# Altium project IT_Asset_Tracking_Rack_Controller-H743.PrjPcb (part 1 of 3)
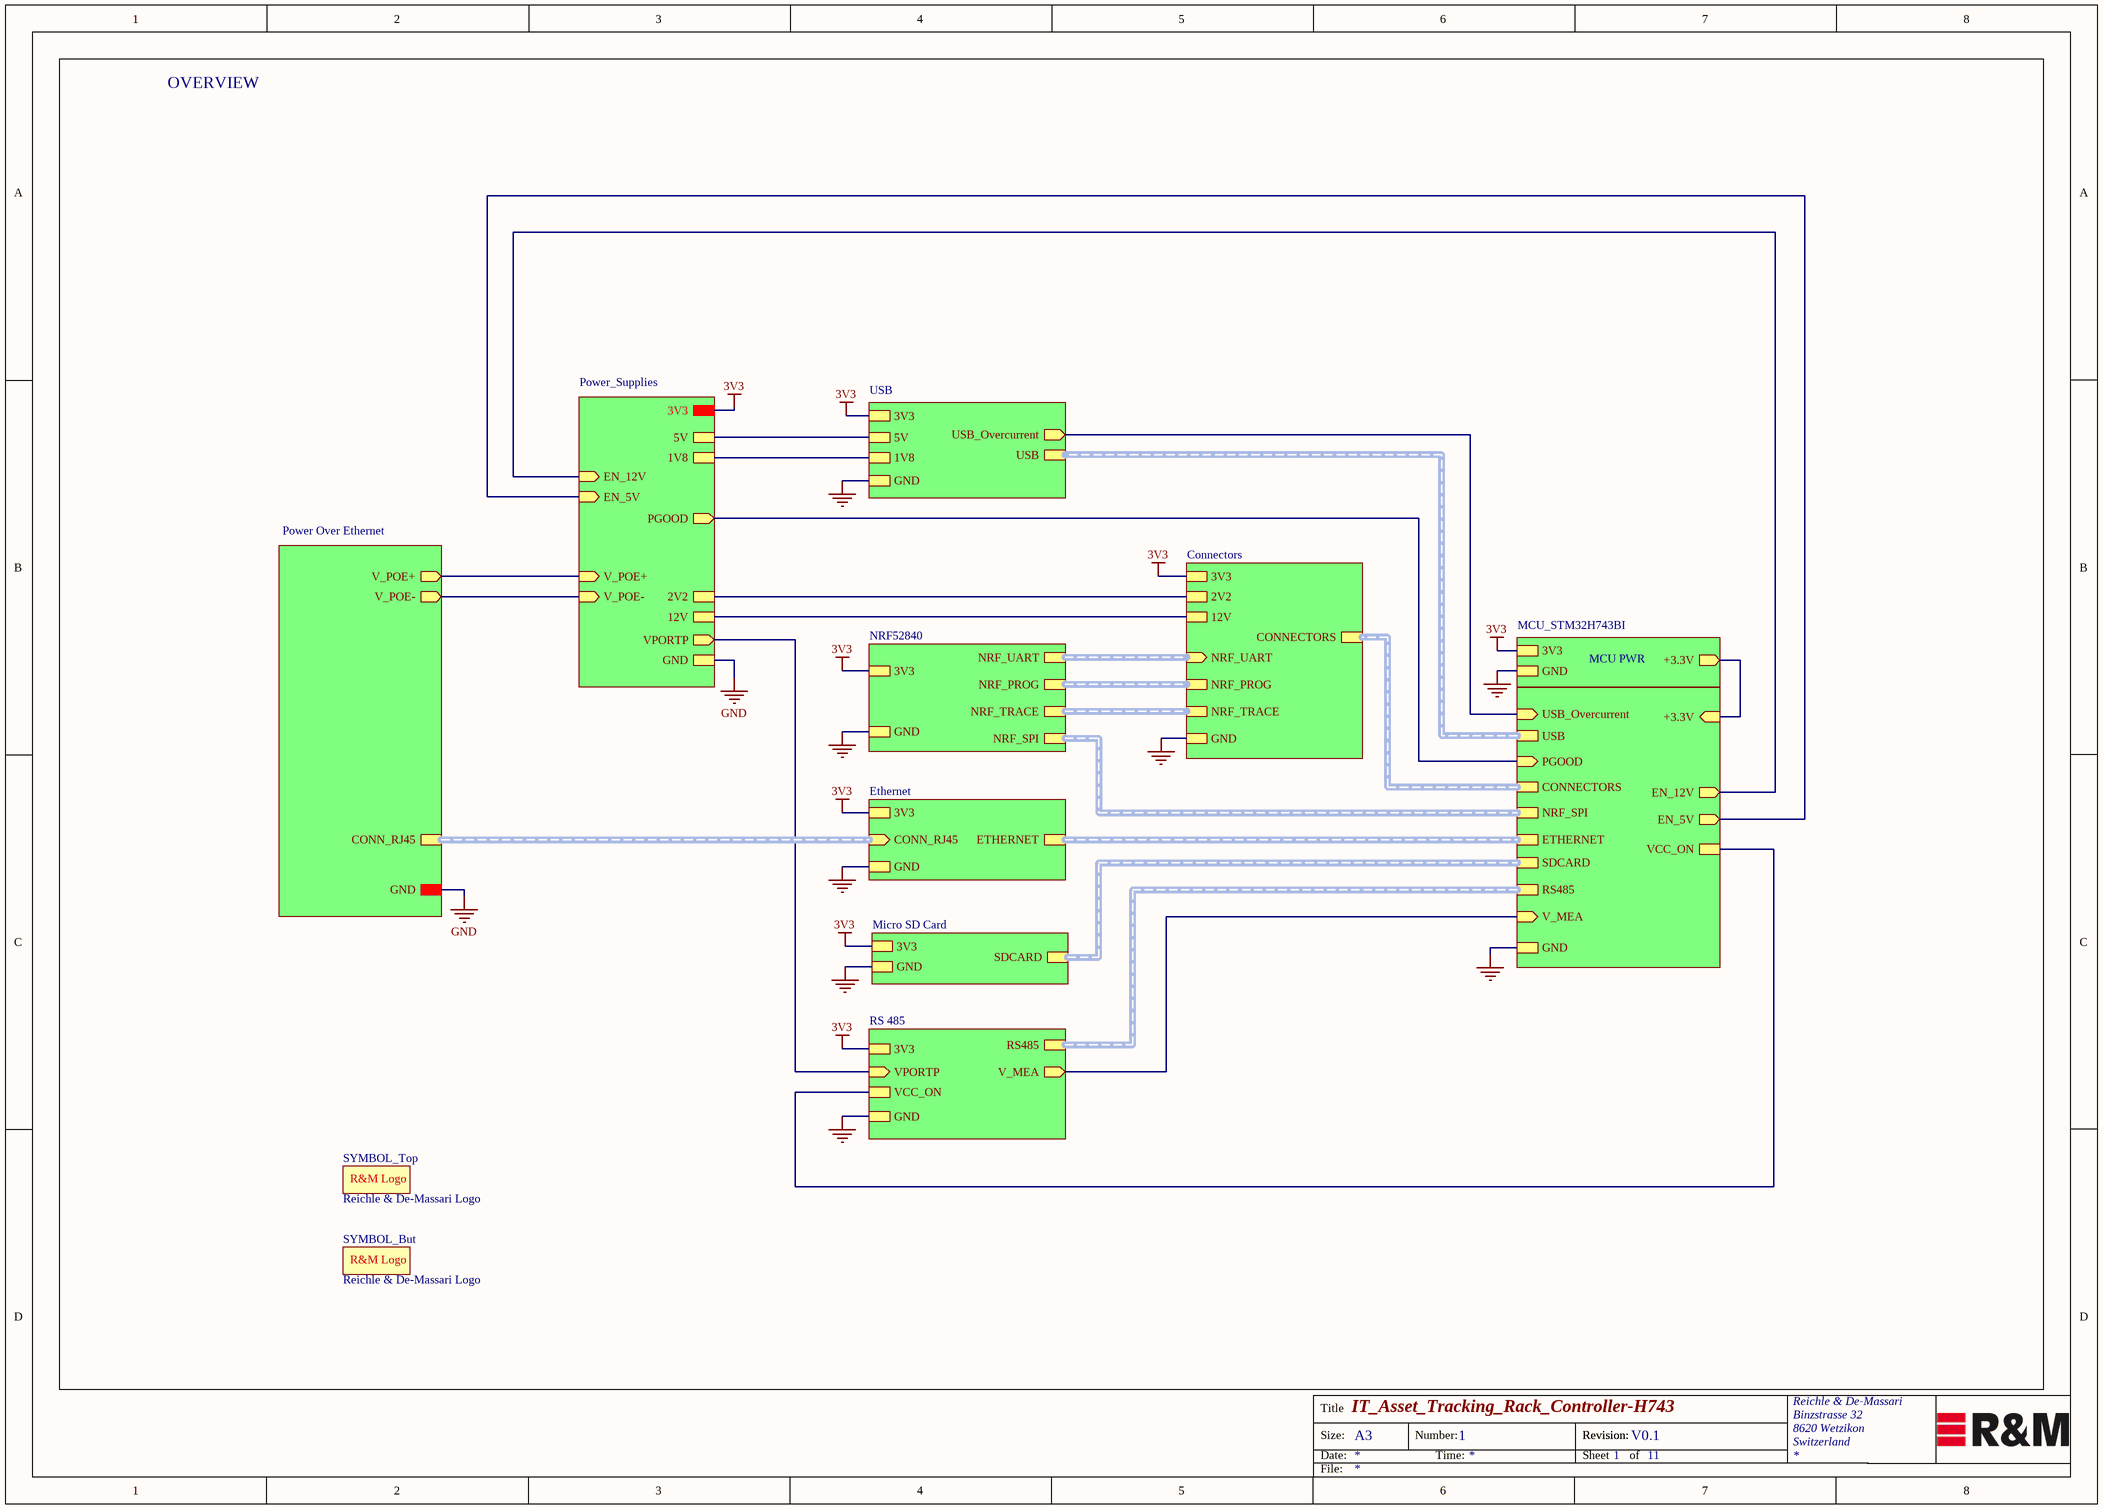
[diagram p0: IT_Asset_Tracking_Rack_Controller-H743.SchDoc]
11 sheets, 255 parts. Net scope: hierarchical (ports join the sheet entries above them; power ports are global).
Board file: IT_Asset_Tracking_Rack_Controller-H743.PcbDoc
Sheets:
  IT_Asset_Tracking_Rack_Controller-H743.SchDoc
    Power Over Ethernet = Power_Over_Ethernet.SchDoc
    USB = USB.SchDoc
    Ethernet = Ethernet.SchDoc
    MCU_STM32H743BI = MCU_STM32H743BI.SchDoc
    MCU PWR = MCU_STM32H743BI_POWER.SchDoc
    Micro SD Card = Micro_SD_Card.SchDoc
    NRF52840 = NRF52840.SchDoc
    RS 485 = RS-485.SchDoc
    Connectors = Connectors.SchDoc
    Power_Supplies = Power_Supplies.SchDoc

## Sheet IT_Asset_Tracking_Rack_Controller-H743.SchDoc: IT_Asset_Tracking_Rack_Controller-H743
size A3; Engineer: Attila Horvath; Organization: Reichle & De-Massari; Address1: Binzstrasse 32; Address2: 8620 Wetzikon; Address3: Switzerland; DocumentNumber: 1; Revision: V0.1; SheetNumber: 1; SheetTotal: 11

### Parts
SYMBOL_But  Reichle & De-Massari Logo  [SYMBOL_R&M]  (net tie)
SYMBOL_Top  Reichle & De-Massari Logo  [SYMBOL_R&M]  (net tie)

### Sub-sheets
Connectors = Connectors.SchDoc: NRF_UART (in, harness NRF_UART), NRF_PROG (harness NRF_PROG), NRF_TRACE (harness NRF_TRACE), CONNECTORS (harness CONNECTORS), 3V3, 2V2, 12V, GND
Ethernet = Ethernet.SchDoc: 3V3, GND, CONN_RJ45 (in, harness CONN_RJ45), ETHERNET (harness ETHERNET)
MCU PWR = MCU_STM32H743BI_POWER.SchDoc: 3V3, GND, +3.3V (out)
MCU_STM32H743BI = MCU_STM32H743BI.SchDoc: USB (harness USB), ETHERNET (harness ETHERNET), SDCARD (harness SD_CARD), NRF_SPI (harness NRF_SPI), USB_Overcurrent (in), RS485 (harness MCU_RS485), EN_12V (out), EN_5V (out), V_MEA (in), GND, CONNECTORS (harness CONNECTORS), +3.3V (in), PGOOD (in), VCC_ON
Micro SD Card = Micro_SD_Card.SchDoc: 3V3, GND, SDCARD (harness SD_CARD)
NRF52840 = NRF52840.SchDoc: 3V3, GND, NRF_TRACE (harness NRF_TRACE), NRF_SPI (harness NRF_SPI), NRF_UART (harness NRF_UART), NRF_PROG (harness NRF_PROG)
Power Over Ethernet = Power_Over_Ethernet.SchDoc: V_POE+ (out), V_POE- (out), CONN_RJ45 (harness CONN_RJ45), GND
Power_Supplies = Power_Supplies.SchDoc: 3V3, 5V, 1V8, 2V2, 12V, V_POE- (in), V_POE+ (in), EN_5V (in), EN_12V (in), GND, PGOOD (out), VPORTP (out)
RS 485 = RS-485.SchDoc: 3V3, GND, RS485 (harness MCU_RS485), V_MEA (out), VCC_ON, VPORTP (in)
USB = USB.SchDoc: 1V8, 3V3, 5V, USB (harness USB), USB_Overcurrent (out), GND

### Nets
1V8: sheet USB/1V8, sheet Power_Supplies/1V8
2V2OUT: sheet Connectors/2V2, sheet Power_Supplies/2V2
3V3: sheet USB/3V3, sheet Ethernet/3V3, sheet MCU PWR/3V3, sheet Micro SD Card/3V3, sheet NRF52840/3V3, sheet RS 485/3V3, sheet Connectors/3V3, sheet Power_Supplies/3V3
5VOUT: sheet USB/5V, sheet Power_Supplies/5V
12VOUT: sheet Connectors/12V, sheet Power_Supplies/12V
+3.3V: sheet MCU_STM32H743BI/+3.3V, sheet MCU PWR/+3.3V
GND: sheet Power Over Ethernet/GND, sheet USB/GND, sheet Ethernet/GND, sheet MCU_STM32H743BI/GND, sheet MCU PWR/GND, sheet Micro SD Card/GND, sheet NRF52840/GND, sheet RS 485/GND, sheet Connectors/GND, sheet Power_Supplies/GND
VPORTP: sheet RS 485/VPORTP, sheet Power_Supplies/VPORTP
EN_5V: sheet MCU_STM32H743BI/EN_5V, sheet Power_Supplies/EN_5V
EN_12V: sheet MCU_STM32H743BI/EN_12V, sheet Power_Supplies/EN_12V
PGOOD: sheet MCU_STM32H743BI/PGOOD, sheet Power_Supplies/PGOOD
USB_OverCurrent: sheet USB/USB_Overcurrent, sheet MCU_STM32H743BI/USB_Overcurrent
V_MEA: sheet MCU_STM32H743BI/V_MEA, sheet RS 485/V_MEA
V_POE+: sheet Power Over Ethernet/V_POE+, sheet Power_Supplies/V_POE+
V_POE-: sheet Power Over Ethernet/V_POE-, sheet Power_Supplies/V_POE-
VCC_ON: sheet MCU_STM32H743BI/VCC_ON, sheet RS 485/VCC_ON

### Buses and harness runs
harness sheet Connectors/CONNECTORS = sheet MCU_STM32H743BI/CONNECTORS
harness sheet Connectors/NRF_PROG = sheet NRF52840/NRF_PROG
harness sheet Connectors/NRF_TRACE = sheet NRF52840/NRF_TRACE
harness sheet Connectors/NRF_UART = sheet NRF52840/NRF_UART
harness sheet Ethernet/CONN_RJ45 = sheet Power Over Ethernet/CONN_RJ45
harness sheet Ethernet/ETHERNET = sheet MCU_STM32H743BI/ETHERNET
harness sheet MCU_STM32H743BI/NRF_SPI = sheet NRF52840/NRF_SPI
harness sheet MCU_STM32H743BI/RS485 = sheet RS 485/RS485
harness sheet MCU_STM32H743BI/SDCARD = sheet Micro SD Card/SDCARD
harness sheet MCU_STM32H743BI/USB = sheet USB/USB

### Notes on the sheet
- OVERVIEW
- Title
- Size:
- Date:
- A3
- Number:
- Time:
- Revision:
- Sheet
- of
- File:
- (in symbol SYMBOL_R&M) R&M Logo

### Library data of the parts
SYMBOL_But SYMBOL_Top = SYMBOL_R&M: Replaceable: no; value: Overlay; Footprint/Package: 2.54mm

## Sheet Power_Over_Ethernet.SchDoc: Power over Ethernet
size A3; Organization: Reichle & De-Massari; Address1: Binzstrasse 32; Address2: 8620 Wetzikon; Address3: Switzerland; DocumentNumber: 4; Revision: V0.1; SheetNumber: 4; SheetTotal: 11
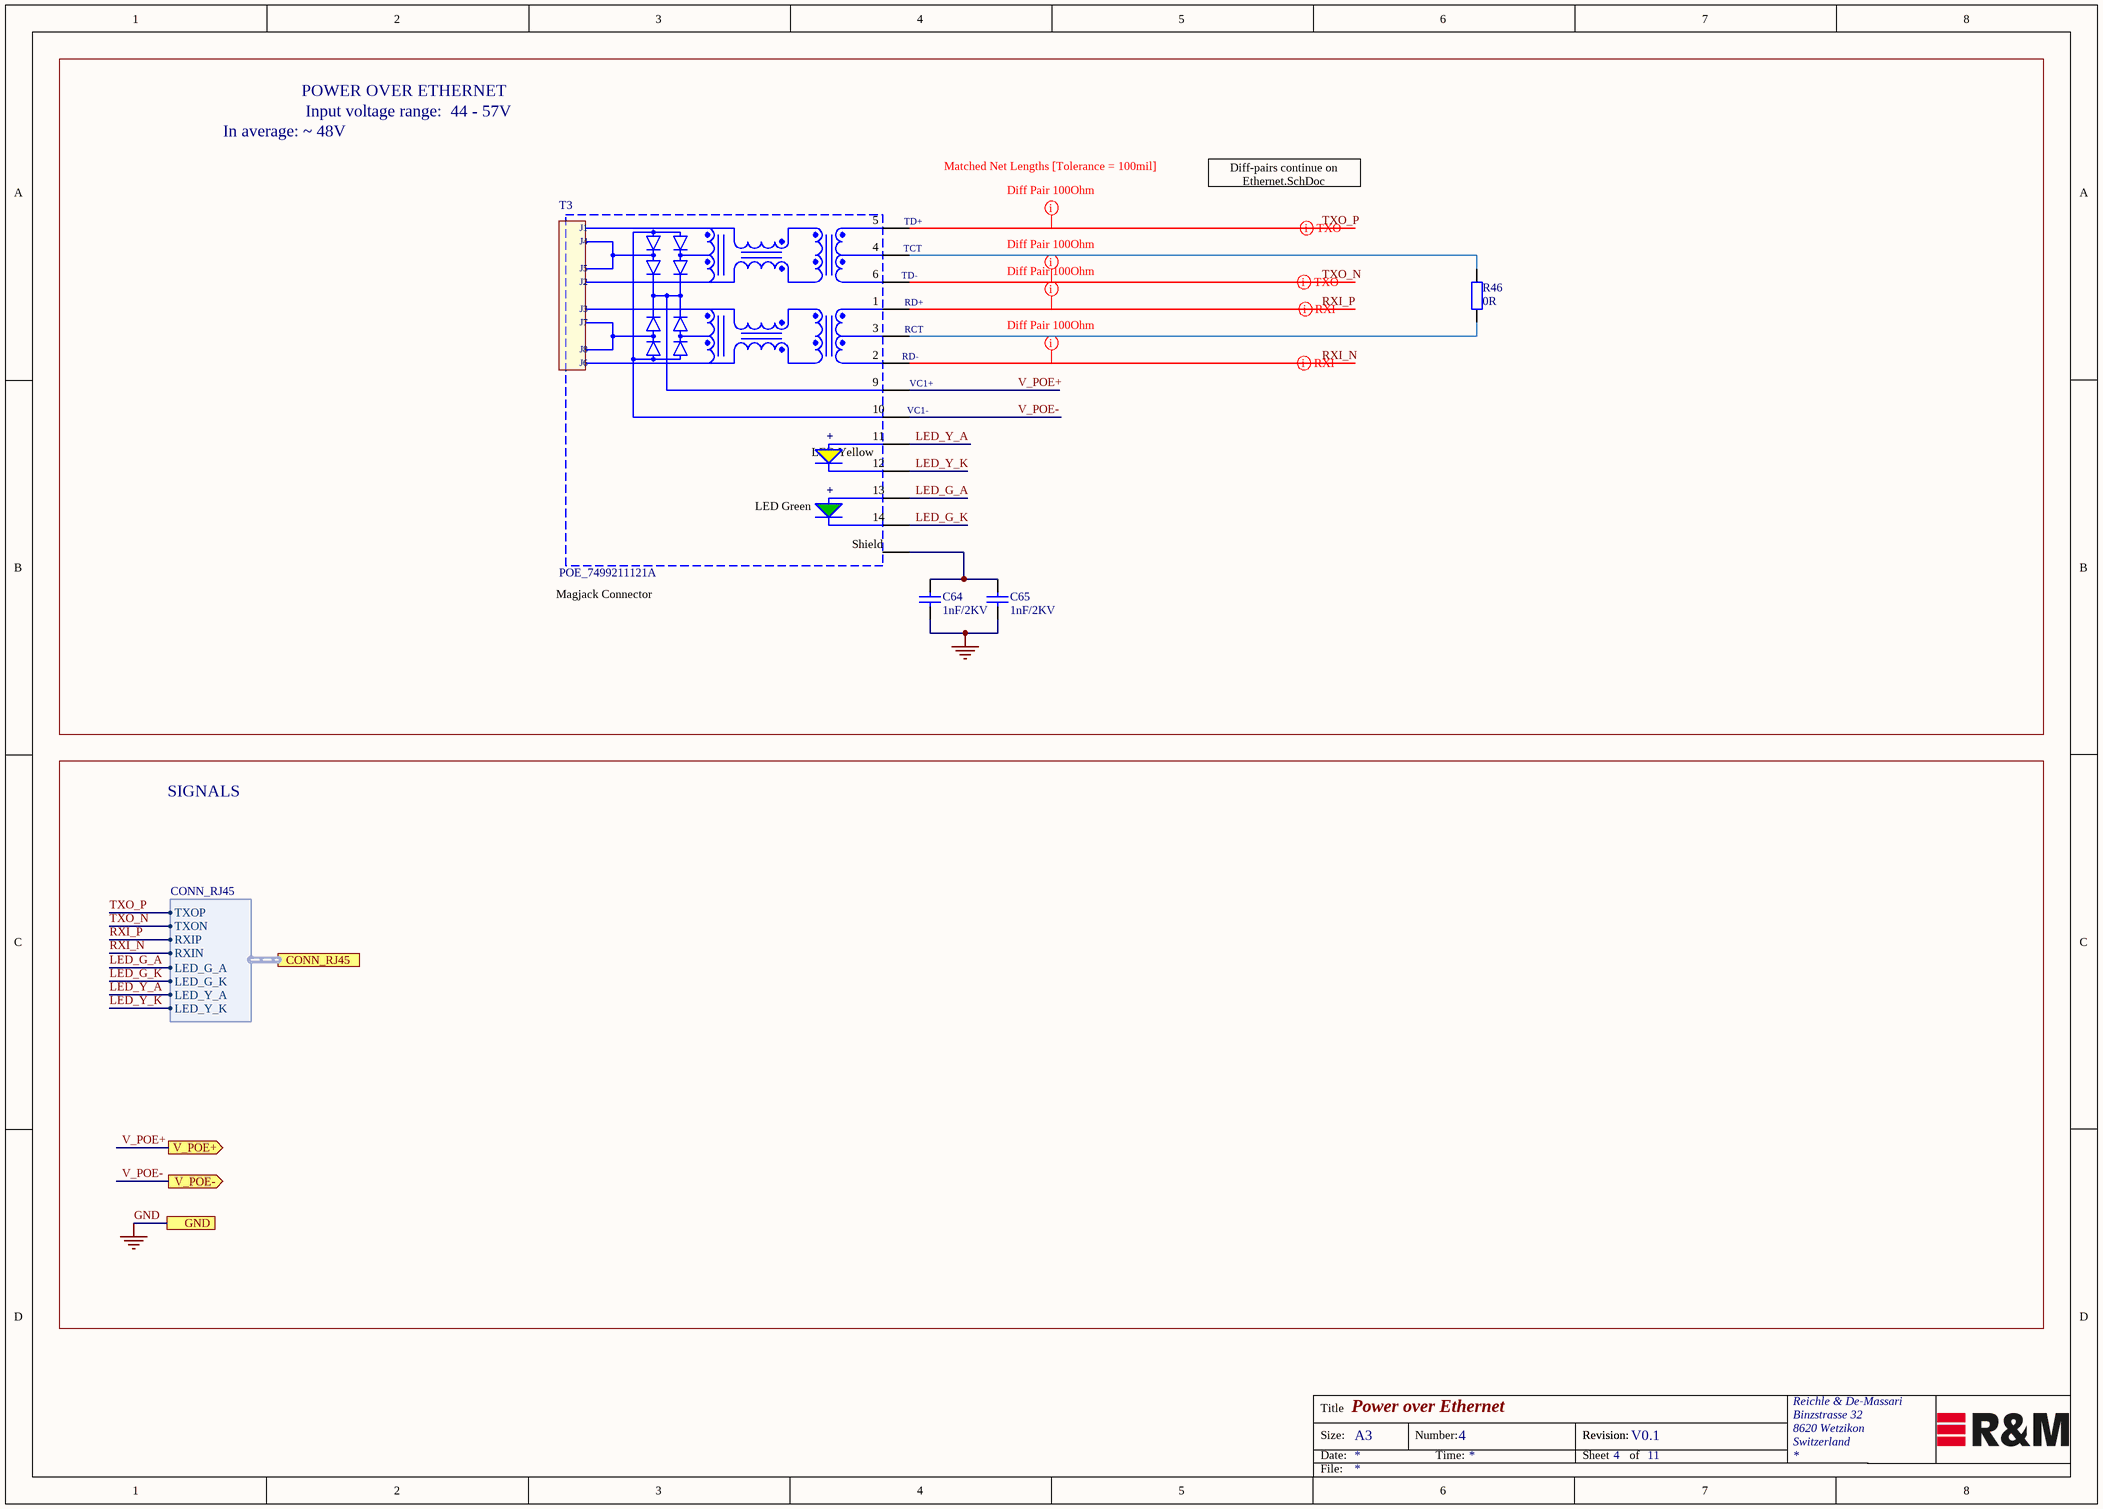
[diagram p1: Power_Over_Ethernet.SchDoc]

### Parts
C64  1nF/2KV  [Ceramic Capacitor 1206 EIA]
C65  1nF/2KV  [Ceramic Capacitor 1206 EIA]
R46  0R  [Resistor 0805 EIA]
T3  POE_7499211121A  [PoE_7499211121A]

### Ports
CONN_RJ45 (harness CONN_RJ45), GND, V_POE+ (out), V_POE- (out)

### Harnesses
CONN_RJ45: TXOP, TXON, RXIP, RXIN, LED_G_A, LED_G_K, LED_Y_A, LED_Y_K

### Nets
GND: C64.1 C65.1 ; port GND
LED_G_A: T3.13 ; port CONN_RJ45.LED_G_A
LED_G_K: T3.14 ; port CONN_RJ45.LED_G_K
LED_Y_A: T3.11 ; port CONN_RJ45.LED_Y_A
LED_Y_K: T3.12 ; port CONN_RJ45.LED_Y_K
RXI_N: T3.2(RD-) ; port CONN_RJ45.RXIN
RXI_P: T3.1(RD+) ; port CONN_RJ45.RXIP
TXO_N: T3.6(TD-) ; port CONN_RJ45.TXON
TXO_P: T3.5(TD+) ; port CONN_RJ45.TXOP
V_POE+: T3.9(VC1+) ; port V_POE+
V_POE-: T3.10(VC1-) ; port V_POE-
NetC64_2: C64.2 C65.2 T3.Shield
NetR46_1: R46.1 T3.4(TCT)
NetR46_2: R46.2 T3.3(RCT)

### Layout directives
mark named Diff Pair 100Ohm: RXI_N, RXI_P, TXO_N, TXO_P
differential pair: RXI_N, RXI_P, TXO_N, TXO_P

### Notes on the sheet
- POWER OVER ETHERNET
- In average: ~ 48V
- Input voltage range:  44 - 57V
- Matched Net Lengths [Tolerance = 100mil]
- Diff-pairs continue on Ethernet.SchDoc
- Magjack Connector
- SIGNALS
- Title
- Size:
- Date:
- A3
- Number:
- Time:
- Revision:
- Sheet
- of
- File:
- (in symbol CONN_RJ45_PoE) J1; J4; J5; J2; J3; J7; J8; J6; +; LED Yellow; LED Green

### Library data of the parts
C64 C65 = Cap_1nF_1206_2000V: 1000pF ±10% 2000V (2kV) Ceramic Capacitor X7R 1206 (3216 Metric); Manufacturer: AVX Corporation; Manufacturer PartNr: 1206GC102KAZ1A; Replaceable: yes; value: 1nF/2KV; tolerance: ±10%; voltage: 2kV; Dielectric Grade: X7R; Footprint/Package: 1206 (3216 Metric); Supplier 1: Digi-Key; Supplier Part Number 1: 478-4600-1-ND
R46 = Res_0R_0805: 0 Ohms Jumper 0.125W, 1/8W Chip Resistor 0805 (2012 Metric) Automotive AEC-Q200 Thick Film; Manufacturer: Panasonic Electronic Components; Manufacturer PartNr: ERJ-6GEY0R00V; Replaceable: yes; value: 0R; tolerance: -; power: 0.125W, 1/8W; Footprint/Package: 0805 (2012 metric); Supplier 1: Digi-Key; Supplier Part Number 1: P0.0ACT-ND
T3 = CONN_RJ45_PoE: Magjack Connector WE-RJ45 (PoE) with LAN Transformer, 10/100 Base-T1 Port RJ45, 10/100 Base-T, AutoMDIX, two LEDs; power: PoE (up to 350 mA); Replaceable: no; tolerance: NA; Manaufacturer: Wurth Elektronik; ComponentLink1Description: Manufacturer; ComponentLink1URL: http://www.we-online.de; ComponentLink2Description: Datasheet; ComponentLink2URL: http://katalog.we-online.de/pbs/datasheet/7499211121A.pdf; Manufacturer PartNr: 7499211121A; Supplier 1: Digi-Key; Supplier Part Number 1: 732-1654-ND; value: POE_7499211121A; DIelectric Grade: NA; voltage: NA

## Sheet USB.SchDoc: USB with connector
size A3; Organization: Reichle & De-Massari; Address1: Binzstrasse 32; Address2: 8620 Wetzikon; Address3: Switzerland; DocumentNumber: 6; Revision: V0.1; SheetNumber: 6; SheetTotal: 11
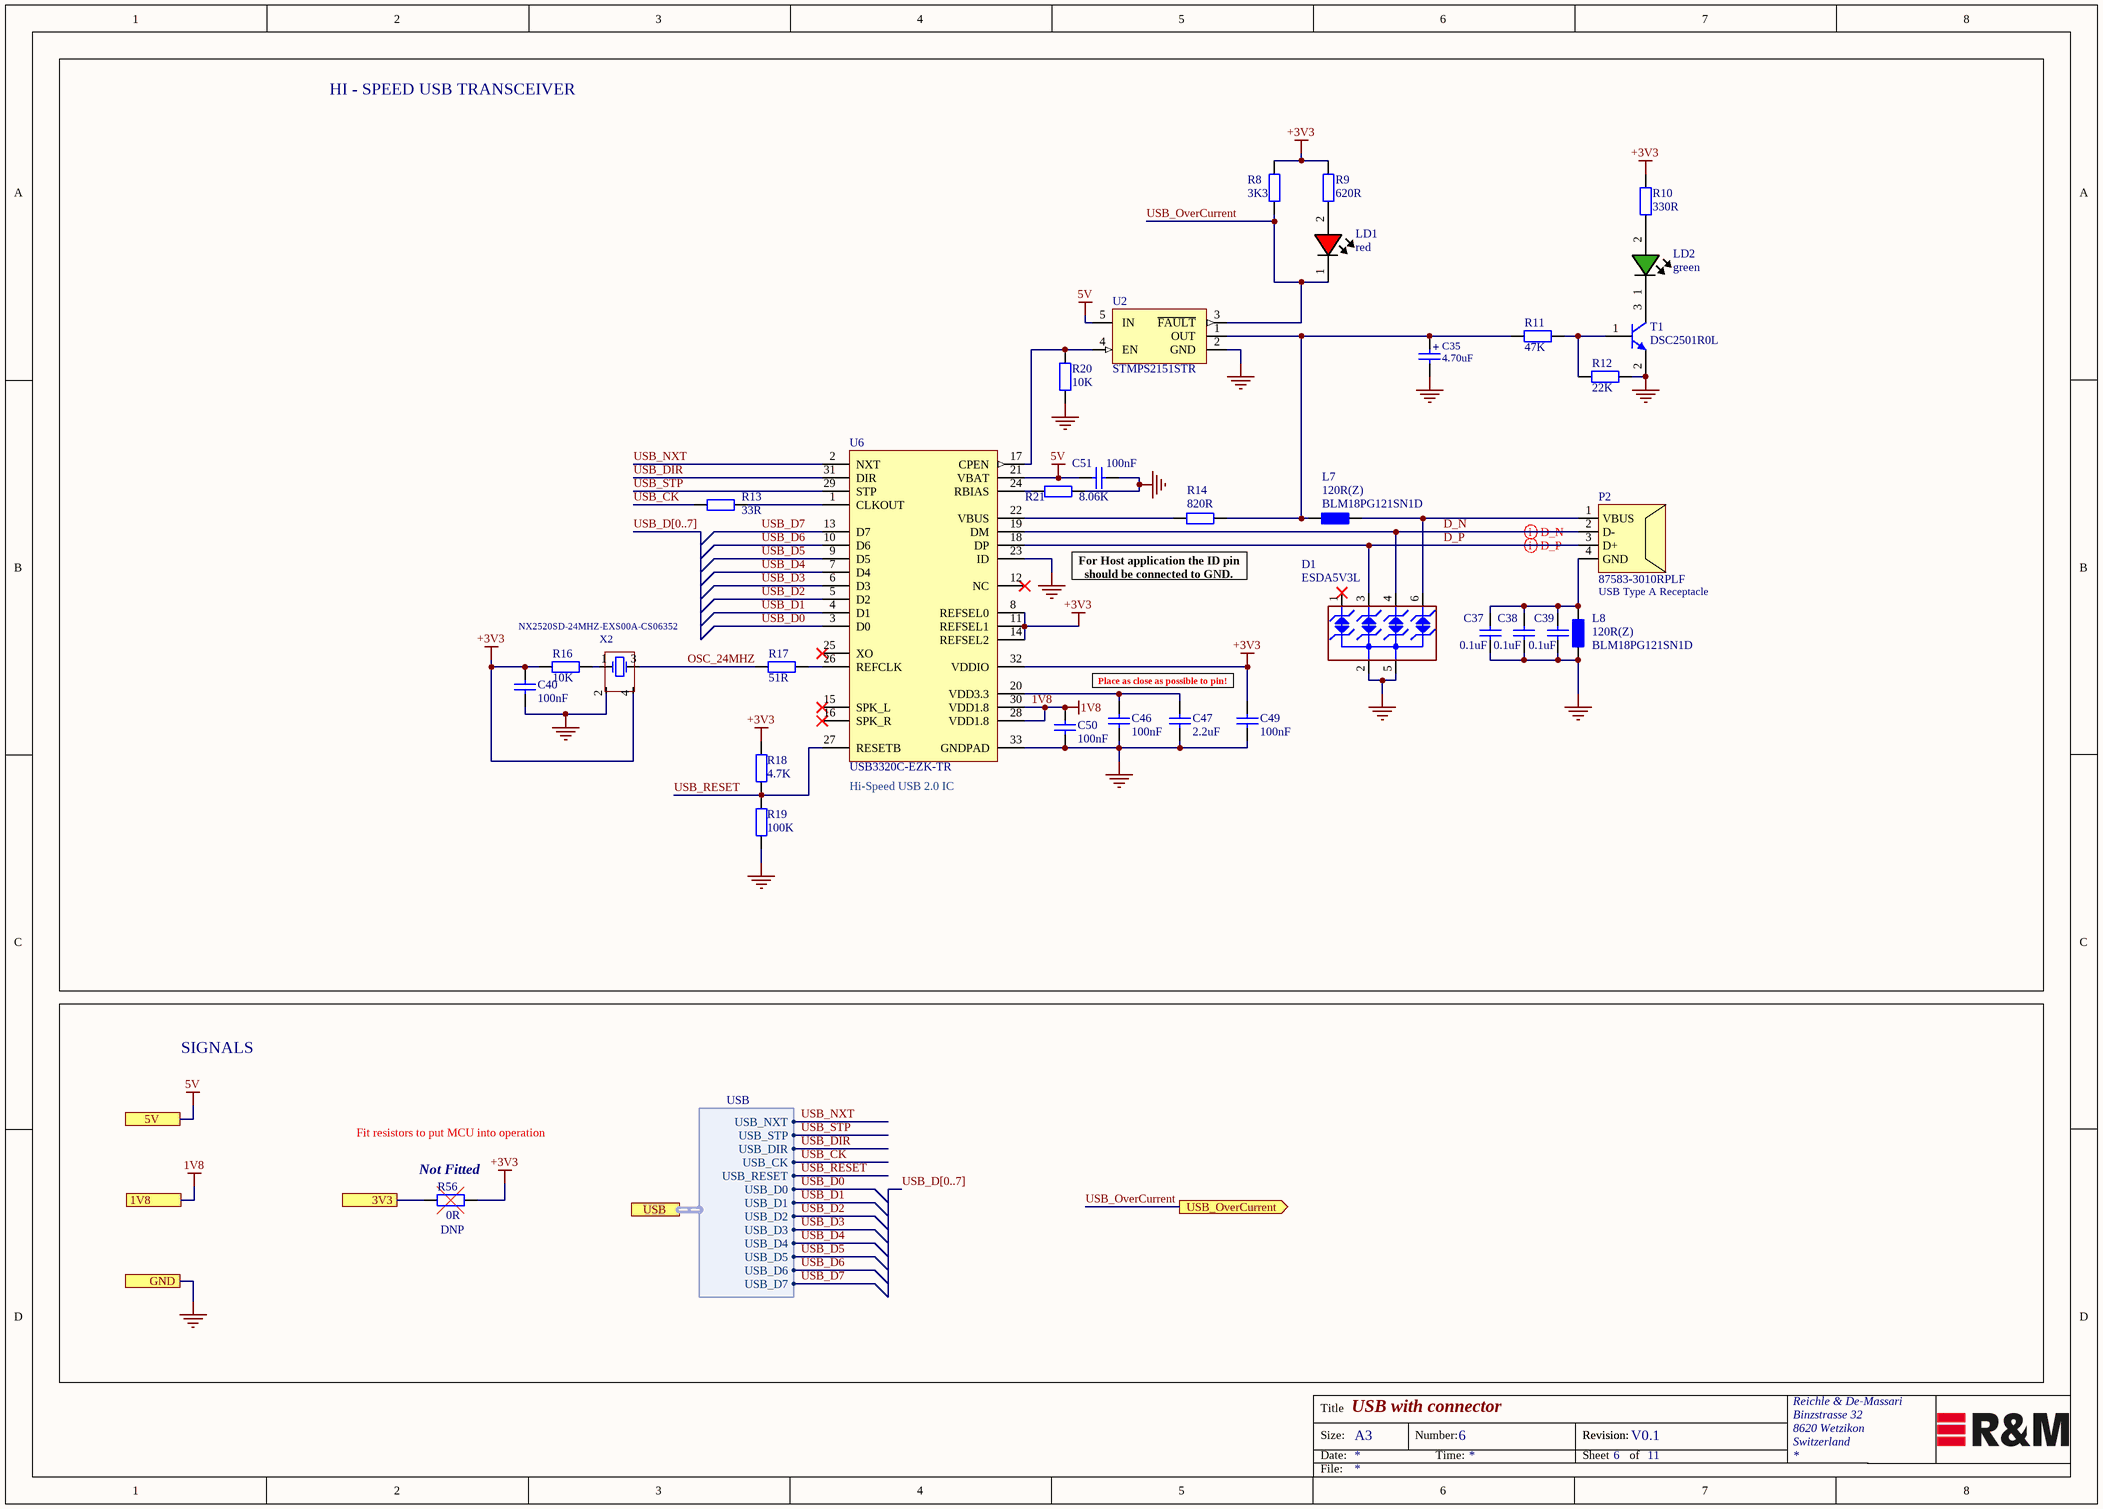
[diagram p2: USB.SchDoc]

### Parts
C35  4.70uF  [CAPC1608X90]
C37  0.1uF  [Ceramic Capacitor 0402 EIA]
C38  0.1uF  [Ceramic Capacitor 0402 EIA]
C39  0.1uF  [Ceramic Capacitor 0402 EIA]
C40  100nF  [Ceramic Capacitor 0402 EIA]
C46  100nF  [Ceramic Capacitor 0402 EIA]
C47  2.2uF  [Ceramic Capacitor 0402 EIA]
C49  100nF  [Ceramic Capacitor 0402 EIA]
C50  100nF  [Ceramic Capacitor 0402 EIA]
C51  100nF  [Ceramic Capacitor 0402 EIA]
D1  ESDA5V3L  [SOT23-6L]
L7  120R(Z)  Manufacturer PartNr: BLM18PG121SN1D  [Inductor 0603 EIA]
L8  120R(Z)  Manufacturer PartNr: BLM18PG121SN1D  [Inductor 0603 EIA]
LD1  red  [LED_APHHS1005CGCK]
LD2  green  [LED_APHHS1005CGCK]
P2  87583-3010RPLF  [CONN_RCPT_USB_TYPE_A]
R8  3K3  [Resistor 0402 EIA]
R9  620R  [Resistor 0402 EIA]
R10  330R  [Resistor 0402 EIA]
R11  47K  [Resistor 0402 EIA]
R12  22K  [Resistor 0402 EIA]
R13  33R  [Resistor 0402 EIA]
R14  820R  [Resistor 0402 EIA]
R16  10K  [Resistor 0402 EIA]
R17  51R  [Resistor 0402 EIA]
R18  4.7K  [Resistor 0402 EIA]
R19  100K  [Resistor 0402 EIA]
R20  10K  [Resistor 0402 EIA]
R21  8.06K  [Resistor 0402 EIA]
R56  DNP  [Resistor 0805 EIA]
T1  DSC2501R0L  [SOT-23/TO-236AA]
U2  STMPS2151STR  [SOT23-5L]
U6  USB3320C-EZK-TR  [QFN32_0R5_5X5]
X2  NX2520SD-24MHZ-EXS00A-CS06352  [NX2520SD-24MHZ-EX]

### Blocks framed on the sheet
HI - SPEED USB TRANSCEIVER: C35 C37-C40 C46 C47 C49-C51 D1 L7 L8 LD1 LD2 P2 R8-R14 R16-R21 T1 U2 U6 X2
SIGNALS: R56

### Ports
1V8, 3V3, 5V, GND, USB (harness USB), USB_OverCurrent (out)

### Harnesses
USB: USB_STP, USB_DIR, USB_CK, USB_NXT, USB_RESET, USB_D0, USB_D1, USB_D2, USB_D3, USB_D4, USB_D5, USB_D6, USB_D7

### Nets
1V8: C50.2 U6.28(VDD1.8) U6.30(VDD1.8) ; port 1V8
3V3: R56.1 ; port 3V3
5V: C51.2 U2.5(IN) U6.21(VBAT) ; port 5V  [project net 5VOUT]
+3V3: C40.2 C49.2 R8.2 R9.1 R10.1 R16.1 R18.1 R56.2 U6.8(REFSEL0) U6.11(REFSEL1) U6.14(REFSEL2) U6.32(VDDIO) X2.4(OSC3)
GND: C35.2(Neg) C37.1 C38.1 C39.1 C40.1 C46.1 C47.1 C49.1 C50.1 C51.1 D1.2(IO2) D1.5(IO4) L8.1 R12.2 R19.2 R20.2 R21.2 T1.2(E) U2.2(GND) U6.23(ID) U6.33(GNDPAD) X2.2(OSC2) ; port GND
D_N: D1.4(IO3) P2.2(D-) U6.19(DM)
D_P: D1.3(GND) P2.3(D+) U6.18(DP)
OSC_24MHZ: R17.1 X2.3(OSC2)
USB_CK: R13.1 ; port USB.USB_CK
USB_D0: U6.3(D0) ; port USB.USB_D0
USB_D1: U6.4(D1) ; port USB.USB_D1
USB_D2: U6.5(D2) ; port USB.USB_D2
USB_D3: U6.6(D3) ; port USB.USB_D3
USB_D4: U6.7(D4) ; port USB.USB_D4
USB_D5: U6.9(D5) ; port USB.USB_D5
USB_D6: U6.10(D6) ; port USB.USB_D6
USB_D7: U6.13(D7) ; port USB.USB_D7
USB_DIR: U6.31(DIR) ; port USB.USB_DIR
USB_NXT: U6.2(NXT) ; port USB.USB_NXT
USB_OverCurrent: LD1.1 R8.1 U2.3(~{FAULT}) ; port USB_OverCurrent
USB_RESET: R18.2 R19.1 U6.27(RESETB) ; port USB.USB_RESET  [project net ETH_NRST]
USB_STP: U6.29(STP) ; port USB.USB_STP
NetC35_1: C35.1(Pos) L7.1 R11.1 R14.2 U2.1(OUT)
NetC37_2: C37.2 C38.2 C39.2 L8.2 P2.4(GND)
NetC46_2: C46.2 C47.2 U6.20(VDD3.3)
NetD1_6: D1.6(NC) L7.2 P2.1(VBUS)
NetLD2_2: LD2.2 R10.2
NetR11_2: R11.2 R12.1 T1.1(B)
NetR13_2: R13.2 U6.1(CLKOUT)
NetR14_1: R14.1 U6.22(VBUS)
NetR16_2: R16.2 X2.1(OSC1)
NetR17_2: R17.2 U6.26(REFCLK)
NetR20_1: R20.1 U2.4(EN) U6.17(CPEN)
NetR21_1: R21.1 U6.24(RBIAS)

Not connected (* = marked no-connect by the designer): D1 1(IO1)*; LD1 2; LD2 1; R9 2; T1 3(C); U6 12(NC)* 15(SPK_L)* 16(SPK_R)* 25(XO)*

### Buses and harness runs
bus USB_D[0..7]

### Layout directives
differential pair: D_N, D_P

### Notes on the sheet
- (near R14) For Host application the ID pin should be connected to GND.
- Place as close as possible to pin!
- (near U6) Hi-Speed USB 2.0 IC
- Fit resistors to put MCU into operation
- (near R56) Not Fitted
- (near R56) 0R
- Title
- Size:
- Date:
- A3
- Number:
- Time:
- Revision:
- Sheet
- of
- File:
- (in symbol Cap_4.7uF_0603_6V3_Tantal) +
- (in symbol CONN_USB_TYPE_A_1) USB Type A Receptacle

### Library data of the parts
C35 = Cap_4.7uF_0603_6V3_Tantal: 4.7µF Molded Tantalum Capacitors 6.3V 0603 (1608 Metric) 7.5Ohm; Manufacturer: AVX Corporation; Manufacturer PartNr: TACL475K006XTA; Replaceable: yes; tolerance: 10 %; Dielectric Grade: TAC; voltage: 6.3V; Footprint/Package: 0603 (1608 Metric); value: 4.70uF; Supplier 1: Digi-Key; Supplier Part Number 1: 478-7522-1-ND
C37-C39 = Cap_0.1uF_0402_16V: 0.1µF ±20% 16V Ceramic Capacitor X7R 0402 (1005 Metric); Manufacturer: KEMET; Manufacturer PartNr: C0402C104M4RACAUTO; voltage: 16VDC; Replaceable: yes; value: 0.1uF; tolerance: 20%; Footprint/Package: 0402 (1005 Metric); Dielectric Grade: X7R; ComponentLink1Description: mouser; ComponentLink1URL: https://www.mouser.ch/ProductDetail/KEMET/C0402C104M4RACAUTO?qs=sGAEpiMZZMs0AnBnWHyRQB295tntAovf0Dzw3tVX6zRfKTwHFThmZw%3d%3d; Supplier 1: Digi-Key; Supplier Part Number 1: 399-13707-1-ND
C40 C46 C49-C51 = Cap_100nF_0402_10V: 0,1µF ±10% 10V Keramikkondensatoren X7R 0402 (1005 metrisch); Manufacturer: Samsung; Manufacturer PartNr: CC0402KRX7R6BB104; Replaceable: yes; volatage: 10VDC; Dielectric Grade: X7R; Footprint/Package: 0402 (1005 metric); Supplier 1: Digi-Key; Supplier Part Number 1: 1276-1002-1-ND; value: 100nF
C47 = Cap_2.2uF_0402_6.3V: Multilayer Ceramic Capacitors MLCC - SMD/SMT 0402 2.2uF 6.3volts *Derate Voltage/Temp; Manufacturer: Murata; Manufacturer PartNr: GRM155R60J225ME15D; tolerance: ±20%; voltage: 6.3VDC; Replaceable: yes; Dielectric Grade: X5R; value: 2.2uF; Footprint/Package: 0402; ComponentLink1Description: digikey; ComponentLink1URL: https://www.digikey.com/product-detail/en/murata-electronics-north-america/GRM155R61E225ME15D/490-10457-2-ND/5027542; Supplier 1: Mouser; Supplier Part Number 1: 81-GRM155R60J225ME5D
D1 = ESDA6V1BC6: Clamp Ipp Tvs Diode Surface Mount SOT-23-6 SMD, used e.g in ESD protection for USB; Manufacturer: STMicroelectronics; Replaceable: no; voltage: 6.1V; value: ESDA5V3L; Manufacturer PartNr: ESDA6V1BC6; Dielectric Grade: -; Supplier Part Number 1: 497-6635-1-ND; Supplier 1: Digi-Key; Footprint/Package: SOT-23-6; tolerance: -
L7 L8 = Ferrit_Bead_0603_BLM18PG121SN1D: 120 Ohms @ 100MHz 1 Power Line Ferrite Bead 0603 (1608 Metric) 2A 50mOhm; Manufacturer: Murata Electronics; Replaceable: yes; value: 120R(Z); tolerance: -; power: -; Footprint/Package: 0603 (1608 metric); Supplier 1: Digi-Key; Supplier Part Number 1: 490-1037-1-ND; Dielectric Grade: -
LD1 = LED_RED_0402: Red 630nm LED Indication - Discrete 1.95V 0402 (1005 Metric); Manufacturer: Kingbright; Manufacturer PartNr: APHHS1005SURCK; Replaceable: yes; voltage: 1.95V (forward); Footprint/Package: 0420 (1005 metric); value: red; Supplier 1: Digi-Key; Supplier Part Number 1: 754-1104-1-ND; Dielectric Grade: -; tolerance: -; power: -
LD2 = LED_GREEN_0402: Green 570nm LED Indication - Discrete 2.1V 0402 (1005 Metric); Manufacturer: Kingbright; Manufacturer PartNr: APHHS1005CGCK; Replaceable: yes; voltage: 2.1V (forward); Footprint/Package: 0420 (1005 metric); value: green; Supplier 1: Digi-Key; Supplier Part Number 1: 754-1101-1-ND; Dielectric Grade: -; tolerance: -; power: -
P2 = CONN_USB_TYPE_A_1: USB - A USB 2.0 Receptacle Connector 4 Position Surface Mount, Right Angle; Manufacturer: Amphenol ICC; Replaceable: no; Footprint/Package: SMD, see datasheet; Supplier 1: Digi-Key; ComponentLink1Description: mouser; ComponentLink1URL: https://www.mouser.ch/ProductDetail/Harwin/M50-3030342?qs=%2fha2pyFaduiRpn7Sn9fWVp%252bNpdzGcgnS82sSCZLLu%2fUjQZVEB%252bIkNw%3d%3d; Supplier Part Number 1: 609-6260-1-ND; power: -; Dielectric Grade: -; Manufacturer PartNr: 87583-3010RPLF; voltage: -; value: 87583-3010RPLF
R8 = Res_3K3_0402: 3.3 kOhms ±0.1% 0.063W, 1/16W Chip Resistor 0402 (1005 Metric) Automotive AEC-Q200 Thin Film; Manufacturer: Panasonic Electronic Components; Manufacturer PartNr: ERA-2AEB332X; Replaceable: yes; Dielectric Grade: -; Footprint/Package: 0402 (1005metric); power: 0.063W, 1/16W; Supplier 1: Digi-Key; Supplier Part Number 1: P3.3KDCCT-ND; tolerance: ±0.1%; value: 3K3
R9 = Res_620R_0402: 620Ohm, SMD 0402,  1/16W  0.5%; Manufacturer: Susumu; Manufacturer PartNr: RR0510P-621-D; power: 62.5mW; Replaceable: yes; Footprint/Package: 0402 (1005 metric); Supplier 1: Mouser; Supplier Part Number 1: 754-RR0510P-621D; tolerance: 0.5%; value: 620R; ComponentLink1Description: mouser; ComponentLink1URL: https://www.mouser.ch/ProductDetail/Susumu/RR0510P-621-D?qs=sGAEpiMZZMu61qfTUdNhG%2fDhcyQpRg8MIBVoO7KVzPo%3d; Supplier 2: Digi-Key; Supplier Part Number 2: RR05P620DDKR-ND
R10 = Res_330R_0402: 330 Ohms ±0.1% 0.063W, 1/16W Chip Resistor 0402 (1005 Metric) Automotive AEC-Q200 Thin Film; Manufacturer: Panasonic Electronic Components; Manufacturer PartNr: ERA-2AEB331X; Replaceable: yes; Dielectric Grade: -; Footprint/Package: 0402 (1005metric); power: 0.063W, 1/16W; Supplier 1: Digi-Key; Supplier Part Number 1: P330DCCT-ND; tolerance: ±0.1%; value: 330R
R11 = Res_47K_0402: 47 kOhms ±5% 0.063W, 1/16W Chip Resistor 0402 (1005 Metric) Automotive AEC-Q200, Moisture Resistant Thick Film; Manufacturer: TE Connectivity; Manufacturer PartNr: CRGCQ0402J47K; power: 62.5mW; Replaceable: yes; Suipplier 1: Digi-Key; value: 47K; tolerance: 5%; Footprint/Package: 0402 (1005); ComponentLink1Description: mouser; ComponentLink1URL: https://www.mouser.ch/ProductDetail/Yageo/RC0402FR-07412KL?qs=sGAEpiMZZMu61qfTUdNhG6gKAQVNBKOozNOFQJr2tME%3d; Supplier Part Number 1: A130058CT-ND
R12 = Res_22K_0402: 22 kOhms ±5%  0402 (1005 metrisch) Thick Film; Manufacturer: Yageo; Manufacturer PartNr: RC0402JR-0722KL; power: 0.063W, 1/16W; Replaceable: yes; value: 22K; tolerance: 5%; Footprint/Package: 0402 (1005 metric); Supplier 1: Digi-Key; Supplier Part Number 1: 311-22KJRCT-ND
R13 = Res_33R_0402: 33 Ohms ±0.1% 0.063W, 1/16W Chip Resistor 0402 (1005 Metric) Thin Film; Manufacturer: TE Connectivity; Manufacturer PartNr: CPF0402B33RE1; Replaceable: yes; Dielectric Grade: -; Footprint/Package: 0402 (1005metric); power: 0.063W, 1/16W; Supplier 1: Digi-Key; Supplier Part Number 1: A102801CT-ND; tolerance: ±0.1%; value: 33R
R14 = Res_820R_0402: 820 Ohms ±1% 0.1W, 1/10W 0402 Thick Film; Manufacturer: Panasonic Electronic Components; Manufacturer PartNr: ERJ-2RKF8200X; Replaceable: yes; value: 820R; tolerance: 1%; power: 0.1W, 1/10W; Footprint/Package: 0402 (1005 metric); Supplier 1: Digi-Key; Supplier Part Number 1: P820LCT-ND
R16 R20 = Res_10K_0402: SMD 10K ohm 1% 50V General Purpose; Manufacturer: Yageo; Manufacturer PartNr: RC0402FR-1010KL; power: 63mW; Replaceable: yes; value: 10K; tolerance: 1%; ComponentLink1Description: mouser; ComponentLink1URL: https://www.mouser.ch/ProductDetail/Yageo/RC0402FR-1010KL?qs=sGAEpiMZZMtlubZbdhIBIEgN9MQql2m6Sb2LnYlCICU%3d; Footprint/Package: 0402; Supplier 1: Mouser; Supplier Part Number 1: 603-RC0402FR-1010KL; Supplier 2: Digi-Key; Supplier Part Number 2: *
R17 = Res_51R_0402: 51 Ohms ±5% 0.063W, 1/16W Chip Resistor 0402 (1005 Metric) , Thick Film; Manufacturer: Yageo; Manufacturer PartNr: RC0402JR-0751RL; power: 62.5mW; Replaceable: yes; value: 51R; tolerance: 5%; Footprint/Package: 0402 (1005  metric); ComponentLink1Description: mouser; ComponentLink1URL: https://www.mouser.ch/ProductDetail/Yageo/RC0402JR-0751RL?qs=sGAEpiMZZMtG0KNrPCHnjTtiZEI2zSDg2UFCMmEjZXQ%3d; Supplier 1: Farnell; Supplier 2: Mouser; Supplier 3: Digi-Key; Supplier Part Number 1: 1799298; Supplier Part Number 2: 603-RC0402JR-0751RL; Supplier Part Number 3: 311-51JRDKR-ND
R18 = Res_4K7_0402: 4.7 kOhms ±5% 0.063W, 1/16W Chip Resistor 0402 (1005 Metric) Moisture Resistant Thick Film; Manufacturer: Yageo; Manufacturer PartNr: RC0402JR-074K7L; Replaceable: yes; Suipplier 1: Digi-Key; value: 4.7K; tolerance: ±5%; power: 0.063W, 1/16W; Footprint/Package: 0402 (1005); ComponentLink1Description: mouser; ComponentLink1URL: https://www.mouser.ch/ProductDetail/Yageo/RC0402FR-07412KL?qs=sGAEpiMZZMu61qfTUdNhG6gKAQVNBKOozNOFQJr2tME%3d; Supplier Part Number 1: 311-4.7KJRCT-ND
R19 = Res_100K_0402: 100 kOhms ±0,1% 0,063W, 1/16W Chip-Widerstand 0402 (1005 metrisch) Dünnschicht; Manufacturer: Yageo; Manufacturer PartNr: RT0402BRD07100KL; tolerance: ±0.1%; Replaceable: yes; value: 100K; power: 0,063W, 1/16W; Footprint/Package: 0402 (1005 metrisch); Supplier 1: Digi-Key; Supplier Part Number 1: YAG1343CT-ND
R21 = Res_8K06_0402: 8.06 kOhms ±1% 0.063W, 1/16W Chip Resistor 0402 (1005 Metric) Moisture Resistant Thick Film; Manufacturer: Yageo; Manufacturer PartNr: 311-8.06KLRCT-ND; Replaceable: yes; Suipplier 1: Digi-Key; value: 8.06K; tolerance: ±1%; power: 0.063W, 1/16W; Footprint/Package: 0402 (1005); ComponentLink1Description: mouser; ComponentLink1URL: https://www.mouser.ch/ProductDetail/Yageo/RC0402FR-07412KL?qs=sGAEpiMZZMu61qfTUdNhG6gKAQVNBKOozNOFQJr2tME%3d; Supplier Part Number 1: RC0402FR-078K06L
R56 = Res_DNP_0805: Resistor: do not populate; Replaceable: no; value: DNP; tolerance: *; power: *; Manufacturer: do not populate; Footprint/Package: 0805; Manufacturer PartNr: do not populate
T1 = BJT_NPN_20V: Bipolar (BJT) Transistor NPN 20V 500mA 150MHz 200mW Surface Mount Mini3-G3-B-B; Manufacturer: Panasonic Electronic Components; Replaceable: no; Supplier 1: Digi-Key; Manufacturer PartNr: DSC2501R0L; Footprint/Package: TO-236-3, SC-59, SOT-23-3; Supplier Part Number 1: DSC2501R0LCT-ND; value: DSC2501R0L; voltage: 20V
U2 = STMPS2151STR: Power Switch/Driver 1:1 N-Kanal 500mA SOT-23-5,  STMicroelectronics; Replaceable: no; voltage: 2,7V ~ 5,5V; Suppplier 1: Digi-Key; Dielectric Grade: -; Manufacturer PartNr: STMPS2151STR; Manufacturer: STMicroelectronics; value: STMPS2151STR; Supplier Part Number 1: 497-6934-1-ND; Footprint/Package: SC-74A, SOT-753
U6 = USB3320C-EZK: USB3320C,  Hi-Speed USB Host, Device or OTG PHY with ULPI Low Pin Interface,  32-QFN (5x5); Manufacturer: Microchip; Replaceable: no; voltage: 1.8V ~ 3.3V; Manufacturer PartNr: USB3320C-EZK-TR; Supplier 1: Digi-Key; Dielectric Grade: -; Supplier Part Number 1: USB3320C-EZK-CT-ND; value: USB3320C-EZK-TR; power: -
X2 = CRYSTAL_4Pad_NX2520SD-24MHZ: 24MHz ±15ppm Crystal 12pF 50 Ohms 4-SMD, No Lead; Manufacturer: NDK America, Inc.; Replaceable: no; Manufacturer PartNr: NX2520SD-24MHZ-EXS00A-CS06352; Footprint/Package: 4-SMD, No Lead; Supplier 1: Digi-Key; Supplier Part Number 1: 644-1214-1-ND; ComponentLink1Description: digikey; ComponentLink1URL: https://www.digikey.com/product-detail/en/abracon-llc/ABM3-12.000MHZ-B2-T/535-9100-2-ND/675295; Load Capacitance: 12 pF; value: NX2520SD-24MHZ-EXS00A-CS06352; Dielectric Grade: -; voltage: -

## Sheet Ethernet.SchDoc: Ethernet
size A3; Author: A.Horvath; Organization: Reichle & De-Massari; Address1: Binzstrasse 32; Address2: 8620 Wetzikon; Address3: Switzerland; DocumentNumber: 8; Revision: V0.1; SheetNumber: 8; SheetTotal: 11
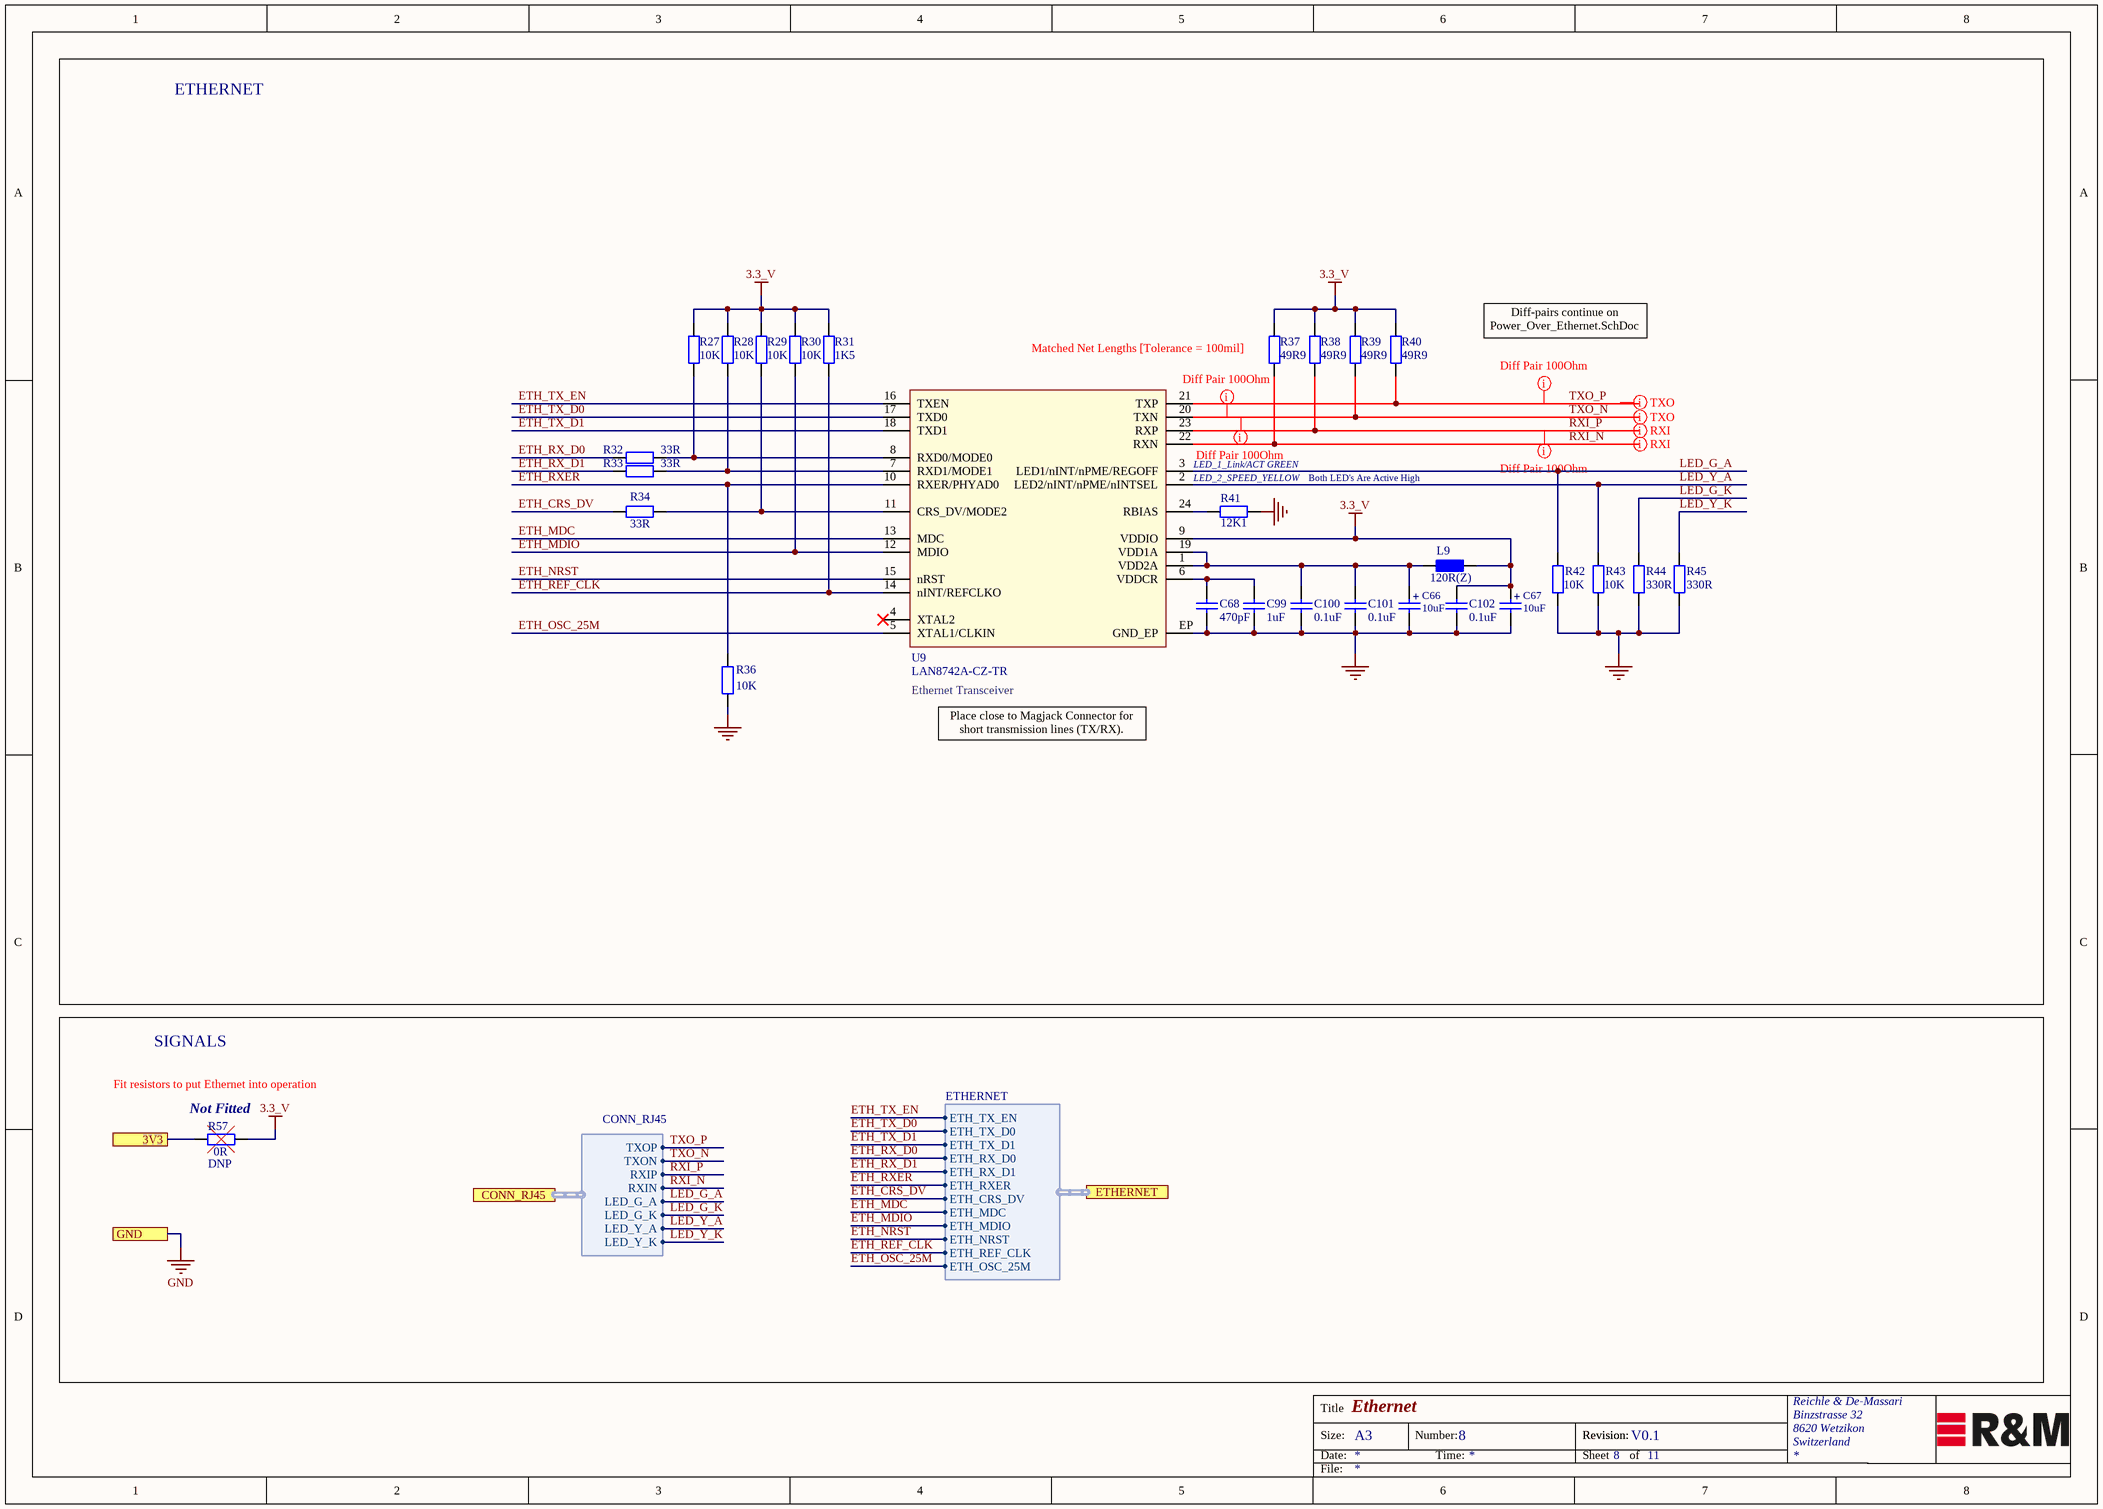
[diagram p3: Ethernet.SchDoc]

### Parts
C66  10uF  [293D106X9010A2TE3]
C67  10uF  [293D106X9010A2TE3]
C68  470pF  [Ceramic Capacitor 0402 EIA]
C99  1uF  [Ceramic Capacitor 0402 EIA]
C100  0.1uF  [Ceramic Capacitor 0402 EIA]
C101  0.1uF  [Ceramic Capacitor 0402 EIA]
C102  0.1uF  [Ceramic Capacitor 0402 EIA]
L9  120R(Z)  [Inductor 0603 EIA]
R27  10K  [Resistor 0402 EIA]
R28  10K  [Resistor 0402 EIA]
R29  10K  [Resistor 0402 EIA]
R30  10K  [Resistor 0402 EIA]
R31  1K5  [Resistor 0402 EIA]
R32  33R  [Resistor 0402 EIA]
R33  33R  [Resistor 0402 EIA]
R34  33R  [Resistor 0402 EIA]
R36  10K  [Resistor 0402 EIA]
R37  49R9  [Resistor 0402 EIA]
R38  49R9  [Resistor 0402 EIA]
R39  49R9  [Resistor 0402 EIA]
R40  49R9  [Resistor 0402 EIA]
R41  12K1  [Resistor 0402 EIA]
R42  10K  [Resistor 0402 EIA]
R43  10K  [Resistor 0402 EIA]
R44  330R  [Resistor 0402 EIA]
R45  330R  [Resistor 0402 EIA]
R57  DNP  [Resistor 0805 EIA]
U9  LAN8742A-CZ-TR  [VQFN24-EPAD_4X4]

### Blocks framed on the sheet
ETHERNET: C66-C68 C99-C102 L9 R27-R34 R36-R45 U9
SIGNALS: R57

### Ports
3V3, CONN_RJ45 (harness CONN_RJ45), ETHERNET (harness ETHERNET), GND

### Harnesses
CONN_RJ45: TXOP, TXON, RXIP, RXIN, LED_G_A, LED_G_K, LED_Y_A, LED_Y_K
ETHERNET: ETH_TX_EN, ETH_TX_D0, ETH_TX_D1, ETH_RX_D0, ETH_RX_D1, ETH_RXER, ETH_CRS_DV, ETH_MDC, ETH_MDIO, ETH_NRST, ETH_REF_CLK, ETH_OSC_25M

### Nets
3.3_V: C67.1(Pos) C102.2 L9.2 R27.1 R28.1 R29.1 R30.1 R31.1 R37.1 R38.1 R39.1 R40.1 R57.2 U9.9(VDDIO)
3V3: R57.1 ; port 3V3
GND: C66.2(Neg) C67.2(Neg) C68.1 C99.1 C100.1 C101.1 C102.1 R36.2 R41.2 R42.2 R43.2 R44.2 R45.2 U9.EP(GND_EP) ; port GND
ETH_CRS_DV: R34.1 ; port ETHERNET.ETH_CRS_DV
ETH_MDC: U9.13(MDC) ; port ETHERNET.ETH_MDC
ETH_MDIO: R30.2 U9.12(MDIO) ; port ETHERNET.ETH_MDIO
ETH_NRST: U9.15(nRST) ; port ETHERNET.ETH_NRST
ETH_OSC_25M: U9.5(XTAL1/CLKIN) ; port ETHERNET.ETH_OSC_25M
ETH_REF_CLK: R31.2 U9.14(nINT/REFCLKO) ; port ETHERNET.ETH_REF_CLK
ETH_RX_D0: R32.1 ; port ETHERNET.ETH_RX_D0
ETH_RX_D1: R33.1 ; port ETHERNET.ETH_RX_D1
ETH_RXER: R36.1 U9.10(RXER/PHYAD0) ; port ETHERNET.ETH_RXER
ETH_TX_D0: U9.17(TXD0) ; port ETHERNET.ETH_TX_D0
ETH_TX_D1: U9.18(TXD1) ; port ETHERNET.ETH_TX_D1
ETH_TX_EN: U9.16(TXEN) ; port ETHERNET.ETH_TX_EN
LED_G_A: R42.1 U9.3(LED1/nINT/nPME/REGOFF) ; port CONN_RJ45.LED_G_A
LED_G_K: R44.1 ; port CONN_RJ45.LED_G_K
LED_Y_A: R43.1 U9.2(LED2/nINT/nPME/nINTSEL) ; port CONN_RJ45.LED_Y_A
LED_Y_K: R45.1 ; port CONN_RJ45.LED_Y_K
RXI_N: R37.2 U9.22(RXN) ; port CONN_RJ45.RXIN
RXI_P: R38.2 U9.23(RXP) ; port CONN_RJ45.RXIP
TXO_N: R39.2 U9.20(TXN) ; port CONN_RJ45.TXON
TXO_P: R40.2 U9.21(TXP) ; port CONN_RJ45.TXOP
NetC66_1: C66.1(Pos) C100.2 C101.2 L9.1 U9.1(VDD2A) U9.19(VDD1A)
NetC68_2: C68.2 C99.2 U9.6(VDDCR)
NetR27_2: R27.2 R32.2 U9.8(RXD0/MODE0)
NetR28_2: R28.2 R33.2 U9.7(RXD1/MODE1)
NetR29_2: R29.2 R34.2 U9.11(CRS_DV/MODE2)
NetR41_1: R41.1 U9.24(RBIAS)

Not connected (* = marked no-connect by the designer): U9 4(XTAL2)*

### Layout directives
mark named Diff Pair 100Ohm: RXI_P, TXO_N, TXO_P
differential pair: (no net found under the mark), RXI_N, RXI_P, TXO_N

### Notes on the sheet
- (near R37) Matched Net Lengths [Tolerance = 100mil]
- Diff-pairs continue on Power_Over_Ethernet.SchDoc
- LED_1_Link/ACT GREEN
- LED_2_SPEED_YELLOW
- Both LED's Are Active High
- (near U9) Ethernet Transceiver
- Place close to Magjack Connector for short transmission lines (TX/RX).
- (near R57) Fit resistors to put Ethernet into operation
- (near R57) Not Fitted
- (near R57) 0R
- Title
- Size:
- Date:
- A3
- Number:
- Time:
- Revision:
- Sheet
- of
- File:
- (in symbol Cap_10uF_1206 _10V_Tantal) +

### Library data of the parts
C66 C67 = Cap_10uF_1206 _10V_Tantal: 10µF Molded Tantalum Capacitors 10V 1206 (3216 Metric) 3.4Ohm; Manufacturer: Vishay Sprague; Replaceable: yes; tolerance: ±10%; Dielectric Grade: TANTAL; Manufacturer PartNr: 293D106X9010A2TE3; voltage: 10V; Footprint/Package: 1206 (3216 metric); value: 10uF; Supplier 1: Digi-Key; Supplier Part Number 1: 718-1121-1-ND
C68 = Cap_470pF_0402_16V: 470pF ±10% 16V Ceramic Capacitor X7R 0402 (1005 Metric); Manufacturer: AVX Corporation; Manufacturer PartNr: 0402YC471KAT2A; voltage: 16VDC; Replaceable: yes; value: 470pF; tolerance: 10%; ComponentLink1Description: mouser; ComponentLink1URL: https://www.mouser.ch/ProductDetail/Murata-Electronics/GRM155R61A472KA01D?qs=sGAEpiMZZMs0AnBnWHyRQJuLogdu9bcTuSYPL0o17LI%3d; Footprint/Package: 0402 (1005 metric); Dielectric Grade: X7R; Supplier 1: Digi-Key; Supplier Part Number 1: 478-12657-1-ND
C99 = Cap_1uF_0603_16V: 1µF ±10% 16V Ceramic Capacitor X5R 0603 (1608 Metric); Manufacturer: Yageo; Manufacturer PartNr: CC0603KRX5R7BB105; voltage: 16VDC; Replaceable: yes; value: 1uF; tolerance: 10%; Footprint/Package: 0603 (1608 Metric); Dielectric Grade: X5R; ComponentLink1Description: mouser; ComponentLink1URL: https://www.mouser.ch/ProductDetail/Murata-Electronics/GCM155C71A105KE38D?qs=sGAEpiMZZMsh%252b1woXyUXj0FEAttKcN54ouz5zO04smg%3d; Supplier Part Number 1: 311-1444-1-ND; Supplier 1: Digi-Key
C100-C102 = Cap_0.1uF_0402_16V_10%: 0.1µF ±10% 16V Ceramic Capacitor X7R 0402 (1005 Metric); Manufacturer: Yageo; Manufacturer PartNr: CC0402KRX7R7BB104; voltage: 16VDC; Replaceable: yes; value: 0.1uF; tolerance: 10%; Footprint/Package: 0402 (1005 Metric); Dielectric Grade: X7R; ComponentLink1Description: mouser; ComponentLink1URL: https://www.mouser.ch/ProductDetail/KEMET/C0402C104M4RACAUTO?qs=sGAEpiMZZMs0AnBnWHyRQB295tntAovf0Dzw3tVX6zRfKTwHFThmZw%3d%3d; Supplier 1: Digi-Key; Supplier Part Number 1: 311-1338-1-ND
L9 = Ferrit_Bead_0603_BLM18PG121SN1D: as L7 on sheet USB; value: 120R(Z); tolerance: -; power: -; Manufacturer PartNr: BLM18PG121SN1D; Footprint/Package: 0603 (1608 metric); Supplier 1: Digi-Key; Supplier Part Number 1: 490-1037-1-ND; Dielectric Grade: -
R27-R30 R36 R42 R43 = Res_10K_0402: as R16 on sheet USB; value: 10K; tolerance: 1%; ComponentLink1Description: mouser; ComponentLink1URL: https://www.mouser.ch/ProductDetail/Yageo/RC0402FR-1010KL?qs=sGAEpiMZZMtlubZbdhIBIEgN9MQql2m6Sb2LnYlCICU%3d; Footprint/Package: 0402; Supplier 1: Mouser; Supplier Part Number 1: 603-RC0402FR-1010KL; Supplier 2: Digi-Key; Supplier Part Number 2: *
R31 = Res_1K5_0402: 1 kOhms ±0.5% 0.063W, 1/16W Chip Resistor 0402 (1005 Metric) Thin Film; Manufacturer: TE Connectivity; Manufacturer PartNr: CRGCQ0402F1K5; tolerance: ±1%; Replaceable: yes; value: 1K5; power: 1/16W; Footprint/Package: 0402 (1005 metric); Supplier 1: Digi-Key; Supplier Part Number 1: A129629CT-ND
R32-R34 = Res_33R_0402: as R13 on sheet USB; Dielectric Grade: -; Footprint/Package: 0402 (1005metric); power: 0.063W, 1/16W; Supplier 1: Digi-Key; Supplier Part Number 1: A102801CT-ND; tolerance: ±0.1%; value: 33R
R37-R40 = Res_49R9_0402: 49.9 Ohms ±0.1% 0.063W, 1/16W Chip Resistor 0402 (1005 Metric) Automotive AEC-Q200 Thin Film; Manufacturer: Panasonic Electronic Components; Manufacturer PartNr: ERA-2AEB49R9X; Replaceable: yes; voltage: NA; value: 49R9; tolerance: ±0.1%; power: 0.063W, 1/16W; Footprint/Package: 0402 (1005 metric); Supplier 1: Digi-Key; Supplier Part Number 1: P49.9DCCT-ND; DIelectric Grade: NA
R41 = Res_12K1_0402: 12.1 kOhms ±1% 0.063W, 1/16W Chip Resistor 0402 (1005 Metric) Moisture Resistant Thick Film; Manufacturer: Yageo; Manufacturer PartNr: RC0402FR-0712K1L; Replaceable: yes; value: 12K1; tolerance: ±1%; power: 1/16W; Footprint/Package: 0402 (1005 metric); Supplier 1: Digi-Key; Supplier Part Number 1: 311-12.1KLRCT-ND
R44 R45 = Res_330R_0402: as R10 on sheet USB; Dielectric Grade: -; Footprint/Package: 0402 (1005metric); power: 0.063W, 1/16W; Supplier 1: Digi-Key; Supplier Part Number 1: P330DCCT-ND; tolerance: ±0.1%; value: 330R
R57 = Res_DNP_0805: as R56 on sheet USB; value: DNP; tolerance: *; power: *; Manufacturer: do not populate; Footprint/Package: 0805; Manufacturer PartNr: do not populate
U9 = LAN8742A-CZ-TR: 10/100M RMII Ethernet transceiver  24-SQFN (4x4); Manufacturer: MICROCHIP; voltage: 1.6V ~ 3.6V; Replaceable: no; Supplier 1: Digi-Key; Supplier Part Number 1: LAN8742A-CZ-CT-ND; tolerance: -; Manufacturer PartNr: LAN8742A-CZ-TR; ComponentLink1Description: Datasheet; ComponentLink1URL: http://tunmcdsvn.tun.st.com/Component_Datasheet_Library/Trunk/IC/MICROCHIP_LAN8742A_RMII_PHY; Footprint/Package: 24-VFQFN Exposed Pad; Dielectric Grade: -; value: LAN8742A-CZ-TR

## Sheet MCU_STM32H743BI.SchDoc: MCU_STM32H743BI
size A3; Author: A.Horvath; Organization: Reichle & De-Massari; Address1: Binzstrasse 32; Address2: 8620 Wetzikon; Address3: Switzerland; DocumentNumber: 10; Revision: V0.1; SheetNumber: 10; SheetTotal: 11
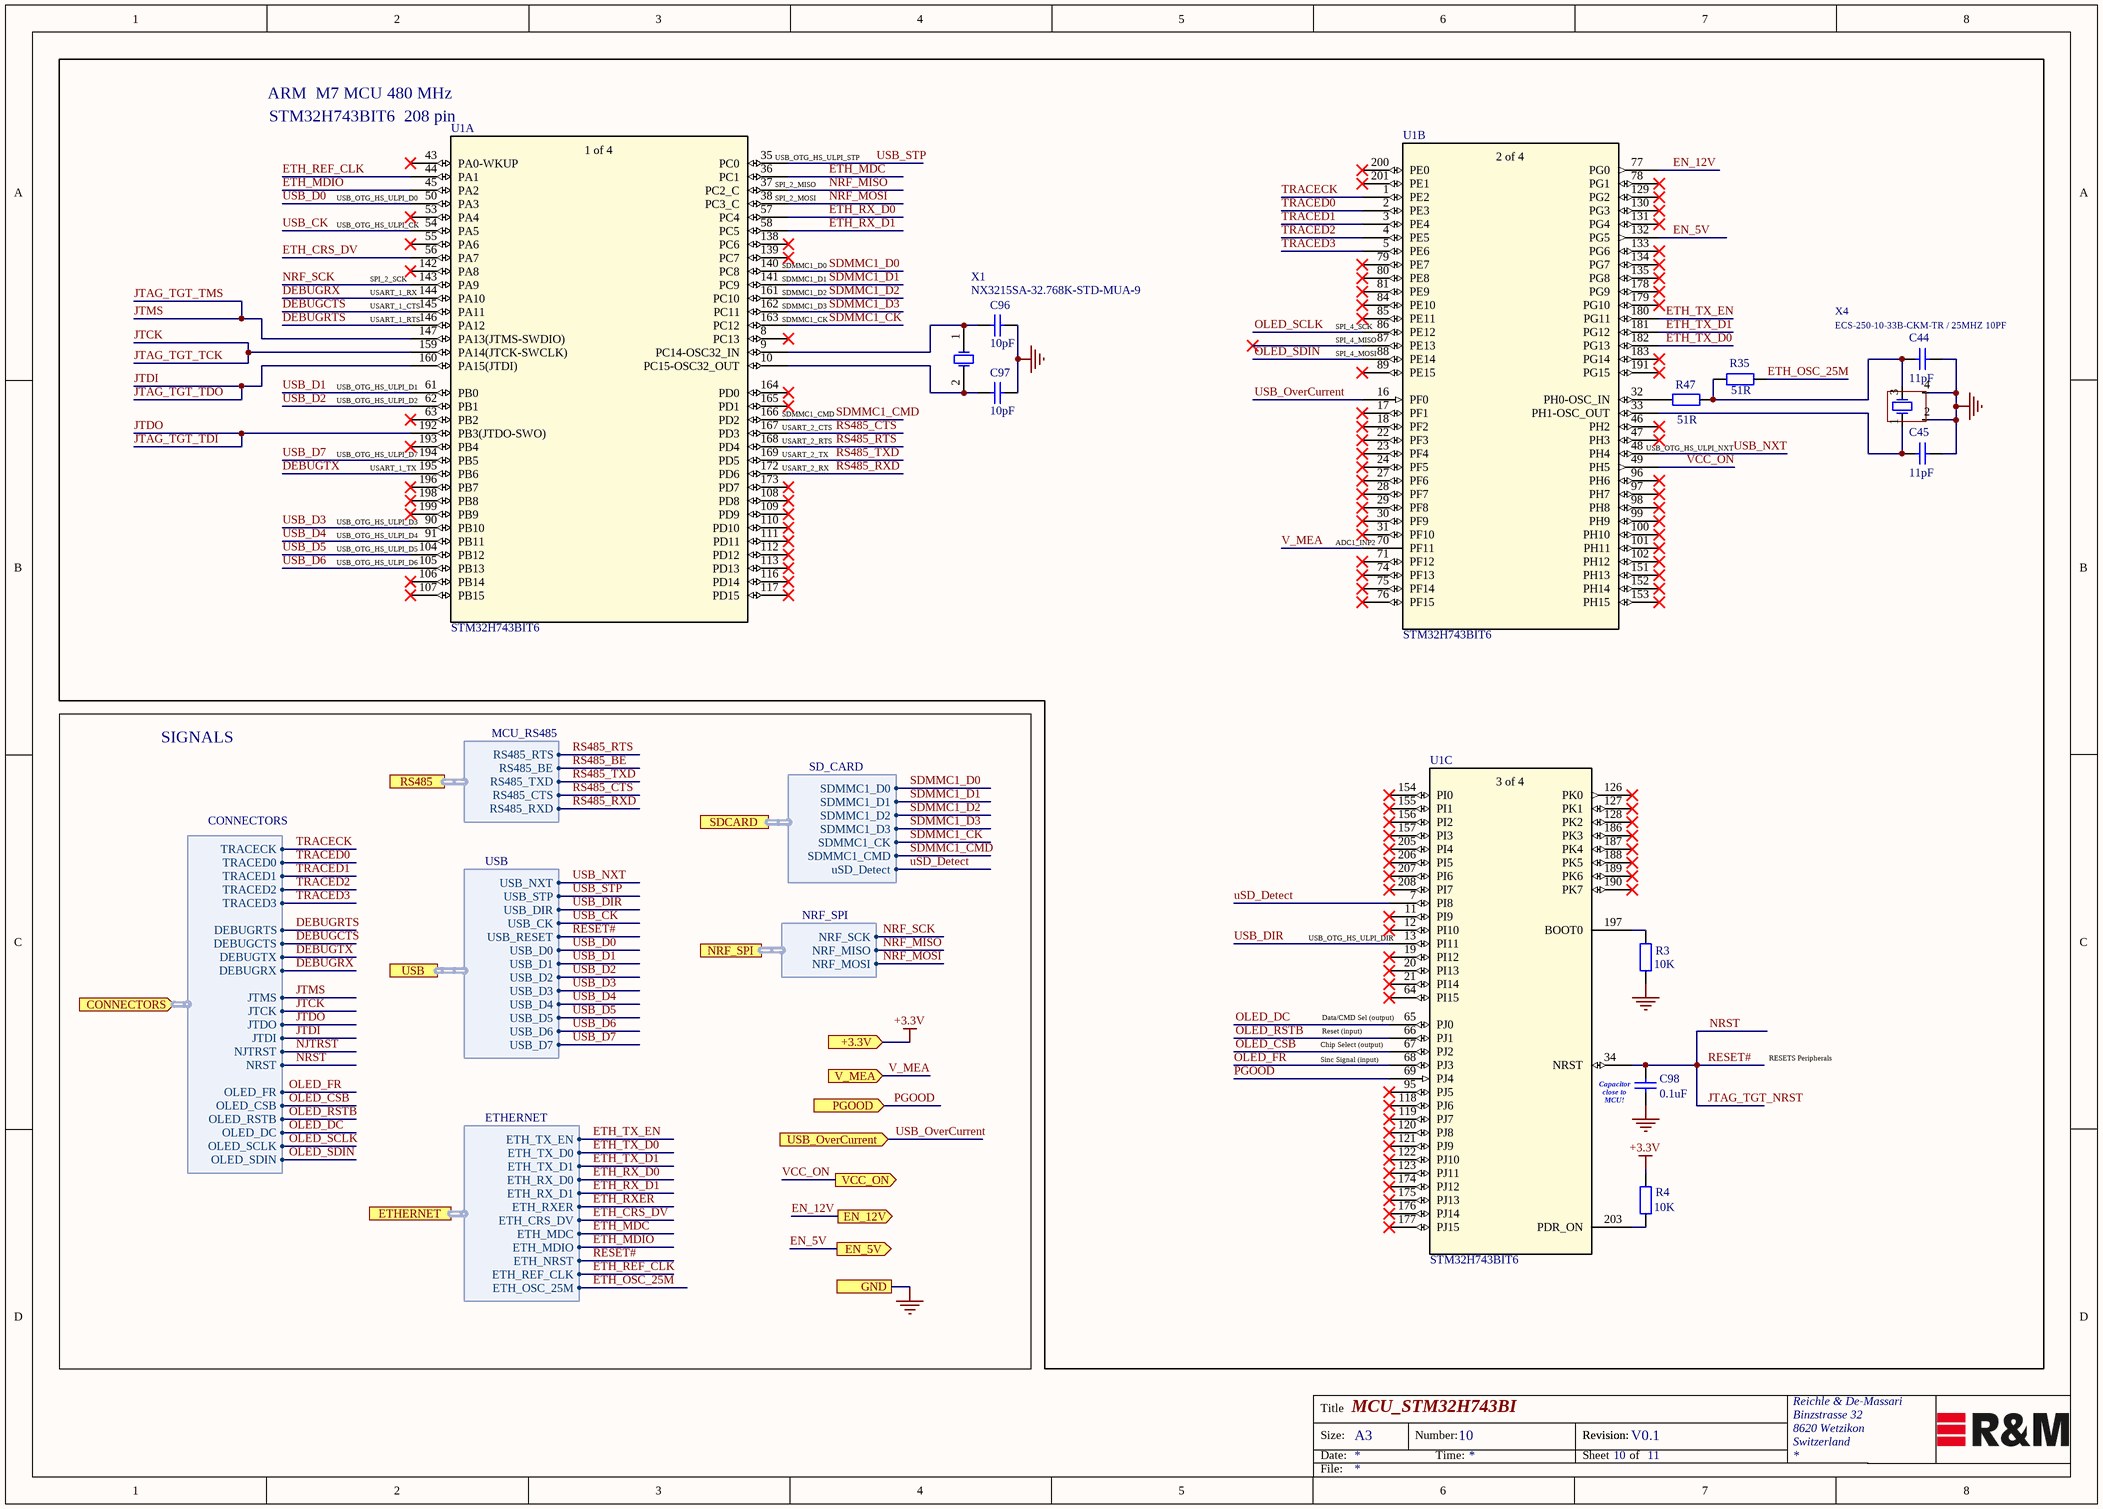
[diagram p4: MCU_STM32H743BI.SchDoc]

### Parts
C44  11pF  [Ceramic Capacitor 0402 EIA]
C45  11pF  [Ceramic Capacitor 0402 EIA]
C96  10pF  [Ceramic Capacitor 0402 EIA]
C97  10pF  [Ceramic Capacitor 0402 EIA]
C98  0.1uF  [Ceramic Capacitor 0402 EIA]
R3  10K  [Resistor 0402 EIA]
R4  10K  [Resistor 0402 EIA]
R35  51R  [Resistor 0402 EIA]
R47  51R  [Resistor 0402 EIA]
U1  STM32H743BIT6  [LQFP208_STM32H743BITx]  (parts A,B,C of 4)
X1  NX3215SA-32.768K-STD-MUA-9  [NX3215SA]
X4  ECS-250-10-33B-CKM-TR / 25MHZ 10PF  [ECS-33B]

### Ports
+3.3V (in), CONNECTORS (in, harness CONNECTORS), EN_5V (out), EN_12V (out), ETHERNET (harness ETHERNET), GND, NRF_SPI (harness NRF_SPI), PGOOD (in), RS485 (harness MCU_RS485), SDCARD (harness SD_CARD), USB (harness USB), USB_OverCurrent (in), V_MEA (in), VCC_ON (out)

### Harnesses
CONNECTORS: OLED_FR, OLED_CSB, OLED_RSTB, OLED_DC, OLED_SCLK, OLED_SDIN, JTMS, JTCK, JTDI, JTDO, NJTRST, NRST, DEBUGRTS, DEBUGCTS, DEBUGTX, DEBUGRX, TRACECK, TRACED0, TRACED1, TRACED2, TRACED3
MCU_RS485: RS485_RXD, RS485_CTS, RS485_TXD, RS485_BE, RS485_RTS
USB: USB_STP, USB_DIR, USB_CK, USB_D0, USB_D1, USB_D2, USB_D3, USB_D4, USB_D5, USB_D6, USB_D7, USB_NXT, USB_RESET
SD_CARD: SDMMC1_D0, SDMMC1_D1, SDMMC1_D2, SDMMC1_D3, SDMMC1_CK, SDMMC1_CMD, uSD_Detect
ETHERNET: ETH_TX_EN, ETH_TX_D0, ETH_TX_D1, ETH_RX_D0, ETH_RX_D1, ETH_RXER, ETH_CRS_DV, ETH_MDC, ETH_MDIO, ETH_NRST, ETH_REF_CLK, ETH_OSC_25M
NRF_SPI: NRF_SCK, NRF_MISO, NRF_MOSI

### Nets
+3.3V: R4.1 ; port +3.3V
GND: C44.1 C45.1 C96.1 C97.1 C98.1 R3.2 X4.2(OSC2) X4.4(OSC3) ; port GND
DEBUGCTS: U1.145(PA11) ; port CONNECTORS.DEBUGCTS
DEBUGRTS: U1.146(PA12) ; port CONNECTORS.DEBUGRTS
DEBUGRX: U1.144(PA10) ; port CONNECTORS.DEBUGRX
DEBUGTX: U1.195(PB6) ; port CONNECTORS.DEBUGTX
EN_5V: U1.132(PG5) ; port EN_5V
EN_12V: U1.77(PG0) ; port EN_12V
ETH_CRS_DV: U1.56(PA7) ; port ETHERNET.ETH_CRS_DV
ETH_MDC: U1.36(PC1) ; port ETHERNET.ETH_MDC
ETH_MDIO: U1.45(PA2) ; port ETHERNET.ETH_MDIO
ETH_OSC_25M: R35.2 ; port ETHERNET.ETH_OSC_25M
ETH_REF_CLK: U1.44(PA1) ; port ETHERNET.ETH_REF_CLK
ETH_RX_D0: U1.57(PC4) ; port ETHERNET.ETH_RX_D0
ETH_RX_D1: U1.58(PC5) ; port ETHERNET.ETH_RX_D1
ETH_TX_D0: U1.182(PG13) ; port ETHERNET.ETH_TX_D0
ETH_TX_D1: U1.181(PG12) ; port ETHERNET.ETH_TX_D1
ETH_TX_EN: U1.180(PG11) ; port ETHERNET.ETH_TX_EN
JTAG_TGT_NRST: C98.2 U1.34(NRST) ; port CONNECTORS.NRST, port USB.USB_RESET, port ETHERNET.ETH_NRST  [also labelled NRST, RESET#]  [project net ETH_NRST]
JTAG_TGT_TCK: U1.159(PA14(JTCK-SWCLK)) ; port CONNECTORS.JTCK  [also labelled JTCK]
JTAG_TGT_TDI: U1.192(PB3(JTDO-SWO)) ; port CONNECTORS.JTDO  [also labelled JTDO]
JTAG_TGT_TDO: U1.160(PA15(JTDI)) ; port CONNECTORS.JTDI  [also labelled JTDI]
JTAG_TGT_TMS: U1.147(PA13(JTMS-SWDIO)) ; port CONNECTORS.JTMS  [also labelled JTMS]
NRF_MISO: U1.37(PC2_C) ; port NRF_SPI.NRF_MISO
NRF_MOSI: U1.38(PC3_C) ; port NRF_SPI.NRF_MOSI
NRF_SCK: U1.143(PA9) ; port NRF_SPI.NRF_SCK
OLED_CSB: U1.67(PJ2) ; port CONNECTORS.OLED_CSB
OLED_DC: U1.65(PJ0) ; port CONNECTORS.OLED_DC
OLED_FR: U1.68(PJ3) ; port CONNECTORS.OLED_FR
OLED_RSTB: U1.66(PJ1) ; port CONNECTORS.OLED_RSTB
OLED_SCLK: U1.86(PE12) ; port CONNECTORS.OLED_SCLK
OLED_SDIN: U1.88(PE14) ; port CONNECTORS.OLED_SDIN
PGOOD: U1.69(PJ4) ; port PGOOD
RS485_CTS: U1.167(PD3) ; port RS485.RS485_CTS
RS485_RTS: U1.168(PD4) ; port RS485.RS485_RTS
RS485_RXD: U1.172(PD6) ; port RS485.RS485_RXD
RS485_TXD: U1.169(PD5) ; port RS485.RS485_TXD
SDMMC1_CK: U1.163(PC12) ; port SDCARD.SDMMC1_CK
SDMMC1_CMD: U1.166(PD2) ; port SDCARD.SDMMC1_CMD
SDMMC1_D0: U1.140(PC8) ; port SDCARD.SDMMC1_D0
SDMMC1_D1: U1.141(PC9) ; port SDCARD.SDMMC1_D1
SDMMC1_D2: U1.161(PC10) ; port SDCARD.SDMMC1_D2
SDMMC1_D3: U1.162(PC11) ; port SDCARD.SDMMC1_D3
TRACECK: U1.1(PE2) ; port CONNECTORS.TRACECK
TRACED0: U1.2(PE3) ; port CONNECTORS.TRACED0
TRACED1: U1.3(PE4) ; port CONNECTORS.TRACED1
TRACED2: U1.4(PE5) ; port CONNECTORS.TRACED2
TRACED3: U1.5(PE6) ; port CONNECTORS.TRACED3
USB_CK: U1.54(PA5) ; port USB.USB_CK
USB_D0: U1.50(PA3) ; port USB.USB_D0
USB_D1: U1.61(PB0) ; port USB.USB_D1
USB_D2: U1.62(PB1) ; port USB.USB_D2
USB_D3: U1.90(PB10) ; port USB.USB_D3
USB_D4: U1.91(PB11) ; port USB.USB_D4
USB_D5: U1.104(PB12) ; port USB.USB_D5
USB_D6: U1.105(PB13) ; port USB.USB_D6
USB_D7: U1.194(PB5) ; port USB.USB_D7
USB_DIR: U1.13(PI11) ; port USB.USB_DIR
USB_NXT: U1.48(PH4) ; port USB.USB_NXT
USB_OverCurrent: U1.16(PF0) ; port USB_OverCurrent
USB_STP: U1.35(PC0) ; port USB.USB_STP
uSD_Detect: U1.7(PI8) ; port SDCARD.uSD_Detect
V_MEA: U1.70(PF11) ; port V_MEA
VCC_ON: U1.49(PH5) ; port VCC_ON
NetC44_2: C44.2 R35.1 R47.2 X4.3(OSC2)
NetC45_2: C45.2 U1.33(PH1-OSC_OUT) X4.1(OSC1)
NetC96_2: C96.2 U1.9(PC14-OSC32_IN) X1.1(OSC1)
NetC97_2: C97.2 U1.10(PC15-OSC32_OUT) X1.2(OSC2)
NetR3_1: R3.1 U1.197(BOOT0)
NetR4_2: R4.2 U1.203(PDR_ON)
NetR47_1: R47.1 U1.32(PH0-OSC_IN)

Not connected (* = marked no-connect by the designer): U1 8(PC13)* 11(PI9)* 12(PI10)* 17(PF1)* 18(PF2)* 19(PI12)* 20(PI13)* 21(PI14)* 22(PF3)* 23(PF4)* 24(PF5)* 27(PF6)* 28(PF7)* 29(PF8)* 30(PF9)* 31(PF10)* 43(PA0-WKUP)* 46(PH2)* 47(PH3)* 53(PA4)* 55(PA6)* 63(PB2)* 64(PI15)* 71(PF12)* 74(PF13)* 75(PF14)* 76(PF15)* 78(PG1)* 79(PE7)* 80(PE8)* 81(PE9)* 84(PE10)* 85(PE11)* 87(PE13)* 89(PE15)* 95(PJ5)* 96(PH6)* 97(PH7)* 98(PH8)* 99(PH9)* 100(PH10)* 101(PH11)* 102(PH12)* 106(PB14)* 107(PB15)* 108(PD8)* 109(PD9)* 110(PD10)* 111(PD11)* 112(PD12)* 113(PD13)* 116(PD14)* 117(PD15)* 118(PJ6)* 119(PJ7)* 120(PJ8)* 121(PJ9)* 122(PJ10)* 123(PJ11)* 126(PK0)* 127(PK1)* 128(PK2)* 129(PG2)* 130(PG3)* 131(PG4)* 133(PG6)* 134(PG7)* 135(PG8)* 138(PC6)* 139(PC7)* 142(PA8)* 151(PH13)* 152(PH14)* 153(PH15)* 154(PI0)* 155(PI1)* 156(PI2)* 157(PI3)* 164(PD0)* 165(PD1)* 173(PD7)* 174(PJ12)* 175(PJ13)* 176(PJ14)* 177(PJ15)* 178(PG9)* 179(PG10)* 183(PG14)* 186(PK3)* 187(PK4)* 188(PK5)* 189(PK6)* 190(PK7)* 191(PG15)* 193(PB4)* 196(PB7)* 198(PB8)* 199(PB9)* 200(PE0)* 201(PE1)* 205(PI4)* 206(PI5)* 207(PI6)* 208(PI7)*

### Notes on the sheet
- ARM  M7 MCU 480 MHz
- STM32H743BIT6  208 pin
- (near U1) USB_OTG_HS_ULPI_STP
- (near U1) USB_OTG_HS_ULPI_D0
- (near U1) USB_OTG_HS_ULPI_CK
- (near U1) SPI_2_MOSI
- (near U1) SPI_2_MISO
- (near U1) USART_1_CTS
- (near U1) USART_1_RX
- (near U1) SPI_2_SCK
- (near U1) SDMMC1_D1
- (near U1) SDMMC1_D0
- (near U1) SDMMC1_D3
- (near U1) SDMMC1_D2
- (near U1) USART_1_RTS
- (near U1) SDMMC1_CK
- (near U1) SPI_4_SCK
- (near U1) SPI_4_MISO
- (near U1) SPI_4_MOSI
- (near U1) USB_OTG_HS_ULPI_D1
- (near U1) USB_OTG_HS_ULPI_D2
- (near U1) USART_2_CTS
- (near U1) USART_2_RTS
- (near U1) SDMMC1_CMD
- (near U1) USB_OTG_HS_ULPI_NXT
- (near U1) USB_OTG_HS_ULPI_D7
- (near U1) USART_1_TX
- (near U1) USART_2_TX
- (near U1) USART_2_RX
- (near U1) USB_OTG_HS_ULPI_D3
- (near U1) USB_OTG_HS_ULPI_D4
- (near U1) USB_OTG_HS_ULPI_D5
- (near U1) USB_OTG_HS_ULPI_D6
- (near U1) ADC1_INP2
- SIGNALS
- (near U1) USB_OTG_HS_ULPI_DIR
- (near U1) Chip Select (output)
- Reset (input)
- (near U1) Data/CMD Sel (output)
- RESETS Peripherals
- (near U1) Sinc Signal (input)
- Capacitor close to MCU!
- Title
- Size:
- Date:
- A3
- Number:
- Time:
- Revision:
- Sheet
- of
- File:
- (in symbol STM32H7x3BIT, part A) 1 of 4
- (in symbol STM32H7x3BIT, part B) 2 of 4
- (in symbol STM32H7x3BIT, part C) 3 of 4

### Library data of the parts
C44 C45 = Cap_11pF_0402_50V: 11pF ±5% 50V Ceramic Capacitor C0G, NP0 0402 (1005 Metric); Manufacturer: Murata; Manufacturer PartNr: GRM1555C1H110JA01D; voltage: 50VDC; Replaceable: yes; Dielectric Grade: C0G (NP0); value: 11pF; tolerance: 5%; Footprint/Package: 0402 (1005 metric); ComponentLink1Description: mouser; ComponentLink1URL: https://www.mouser.ch/ProductDetail/Murata-Electronics/GRM1555C1H110JA01D?qs=%2fha2pyFadug34NHqLs7eMMmZ4IY%2fB%2fBwtGmZmE%252bqlNJIuNiWKDU4cio3ILTIjZ7Z; Supplier 2: Mouser; Supplier 1: Digi-Key; Supplier Part Number 2: 81-GRM1555C1H110JA1D; Supplier Part Number 1: 490-5923-6-ND
C96 C97 = Cap_10pF_0402_50V: 10pF ±1% 50V Ceramic Capacitor C0G, NP0 0402 (1005 Metric); Manufracturer: Murata Electronics; Manufacturer PartNr: GJM1555C1H100FB01D; voltage: 50VDC; Replaceable: yes; Dielectric Grade: C0G (NP0); tolerance: 1%; ComponentLink1Description: mouser; ComponentLink1URL: https://www.mouser.ch/ProductDetail/Murata-Electronics/GRM155R60J475ME47D?qs=sGAEpiMZZMs0AnBnWHyRQIE6q%2f4qwWvwbJmEUwav8%2f4%3d; Footprint/Package: 0402 (1005 metric); Supplier 2: Mouser; Supplier Part Number 2: 81-GJM1555C1H100FB01; value: 10pF; Supplier 1: Digi-Key; Supplier Part Number 1: 0402 (1005 Metric)
C98 = Cap_0.1uF_0402_10V: 0.1µF ±20% 10V Ceramic Capacitor X5R 0402 (1005 Metric); Manufacturer: Wurth Electronics; Manufacturer PartNr: 885012105010; voltage: 10VDC; Replaceable: yes; value: 0.1uF; tolerance: 20%; Footprint/Package: 0402; Dielectric Grade: X5R; ComponentLink1Description: mouser; ComponentLink1URL: https://www.mouser.ch/ProductDetail/Wurth-Electronics/885012105010?qs=sGAEpiMZZMs0AnBnWHyRQEGbLOF2VP1ihL84oCjXnlO407YOHi%2fQbw%3d%3d; Supplier 3: Mouser; Supplier 2: Farnell; Supplier 1: Digi-Key; Supplier Part Number 1: 732-7487-1-ND; Supplier Part Number 2: 2533928; Supplier Part Number 3: 710-885012105010
R3 R4 = Res_10K_0402: as R16 on sheet USB; value: 10K; tolerance: 1%; ComponentLink1Description: mouser; ComponentLink1URL: https://www.mouser.ch/ProductDetail/Yageo/RC0402FR-1010KL?qs=sGAEpiMZZMtlubZbdhIBIEgN9MQql2m6Sb2LnYlCICU%3d; Footprint/Package: 0402; Supplier 1: Mouser; Supplier Part Number 1: 603-RC0402FR-1010KL; Supplier 2: Digi-Key; Supplier Part Number 2: *
R35 R47 = Res_51R_0402_0.5%: 51 Ohms ±0.5% 0.063W, 1/16W Chip Resistor 0402 (1005 Metric) Thin Film; Manufacturer: Susumu; Manufacturer PartNr: RR0510R-510-D; power: 62.5mW; Replaceable: yes; value: 51R; tolerance: ±0.5%; Footprint/Package: 0402 (1005  metric); ComponentLink1Description: mouser; ComponentLink1URL: https://www.mouser.ch/ProductDetail/Yageo/RC0402JR-0751RL?qs=sGAEpiMZZMtG0KNrPCHnjTtiZEI2zSDg2UFCMmEjZXQ%3d; Supplier 1: Digi-Key; Supplier Part Number 1: RR05R51DCT-ND
U1 = STM32H7x3BIT: ARM Cortex-M7 STM32H7 Mikrocontroller IC 32-Bit 480MHz 2MB (2M x 8) FLASH 208-LQFP (28x28); Manufacturer: STMicroelectronics; voltage: 1,62V-3.6V; Replaceable: no; value: STM32H743BIT6; Type: Type; DIelectric Grade: -; Manufacturer PartNr: STM32H743BIT6; power: -; Supplier 1: Digi-Key; Supplier Part Number 1: 497-18562-ND; Footprint/Package: 208-LQFP (28x28); tolerance: -
X1 = CRYSTAL_2Pin_ NX3215SA-32.768K-STD-MUA-9: 32.768kHz ±20ppm Crystal 9pF 70 kOhms 2-SMD, No Lead; Manufacturer: NDK America; Replaceable: no; Footprint/Package: 2-SMD, specific see datasheet; voltage: -; Manufacturer PartNr: NX3215SA-32.768K-STD-MUA-9; value: NX3215SA-32.768K-STD-MUA-9; Supplier 1: Digi-Key; Supplier Part Number 1: 644-1155-1-ND; tolerance: ±20ppm; Dielectric Grade: -; power: -
X4 = CRYSTAL_4Pad_ECS-250-10-33B-CKM-TR: 25MHz ±10ppm Crystal 10pF 40 Ohms 4-SMD, No Lead; Manufacturer: ESC Inc.; Replaceable: no; Manufacturer PartNr: ECS-250-10-33B-CKM-TR; Footprint/Package: 4-SMD, No Lead; Supplier 1: Digi-Key; Supplier Part Number 1: XC2479DKR-ND; ComponentLink1Description: digikey; ComponentLink1URL: https://www.digikey.com/product-detail/en/abracon-llc/ABM3-12.000MHZ-B2-T/535-9100-2-ND/675295; Load Capacitance: 10 pF; value: ECS-250-10-33B-CKM-TR / 25MHZ 10PF; Dielectric Grade: -; voltage: -

## Sheet MCU_STM32H743BI_POWER.SchDoc: MCU_STM32H743BI_POWER
size A3; Author: A.Horvath; Organization: Reichle & De-Massari; Address1: Binzstrasse 32; Address2: 8620 Wetzikon; Address3: Switzerland; DocumentNumber: 7; Revision: V0.1; SheetNumber: 7; SheetTotal: 11
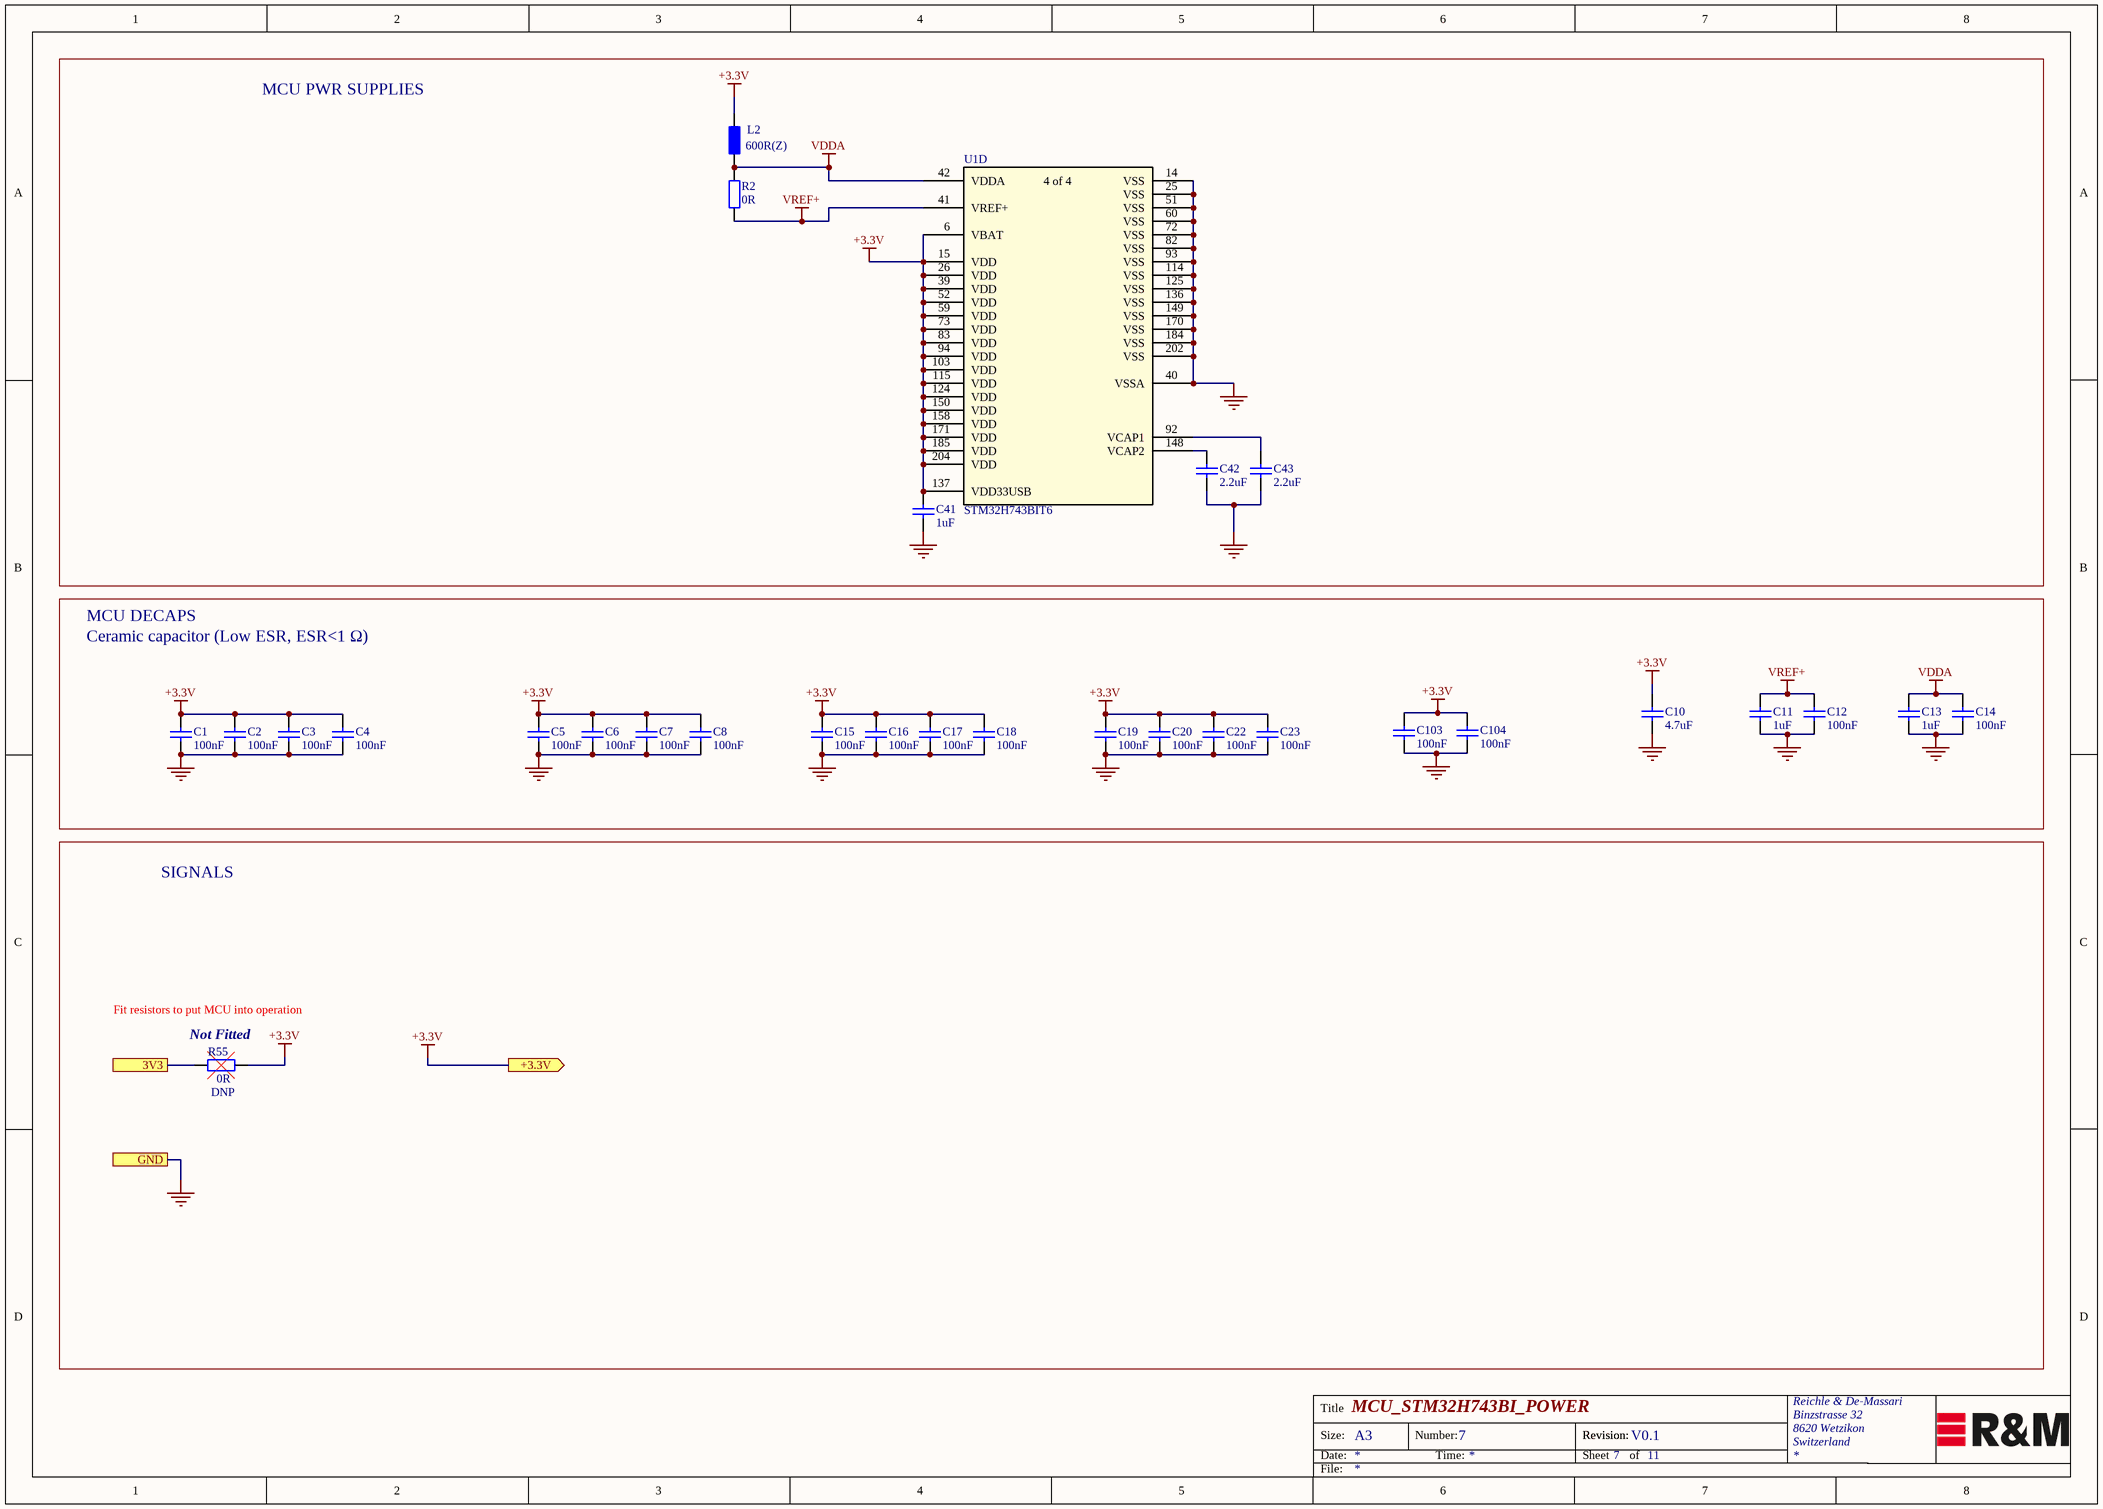
[diagram p5: MCU_STM32H743BI_POWER.SchDoc]

### Parts
C1  100nF  [Ceramic Capacitor 0402 EIA]
C2  100nF  [Ceramic Capacitor 0402 EIA]
C3  100nF  [Ceramic Capacitor 0402 EIA]
C4  100nF  [Ceramic Capacitor 0402 EIA]
C5  100nF  [Ceramic Capacitor 0402 EIA]
C6  100nF  [Ceramic Capacitor 0402 EIA]
C7  100nF  [Ceramic Capacitor 0402 EIA]
C8  100nF  [Ceramic Capacitor 0402 EIA]
C10  4.7uF  [Ceramic Capacitor 0603 EIA]
C11  1uF  [Ceramic Capacitor 0603 EIA]
C12  100nF  [Ceramic Capacitor 0402 EIA]
C13  1uF  [Ceramic Capacitor 0603 EIA]
C14  100nF  [Ceramic Capacitor 0402 EIA]
C15  100nF  [Ceramic Capacitor 0402 EIA]
C16  100nF  [Ceramic Capacitor 0402 EIA]
C17  100nF  [Ceramic Capacitor 0402 EIA]
C18  100nF  [Ceramic Capacitor 0402 EIA]
C19  100nF  [Ceramic Capacitor 0402 EIA]
C20  100nF  [Ceramic Capacitor 0402 EIA]
C22  100nF  [Ceramic Capacitor 0402 EIA]
C23  100nF  [Ceramic Capacitor 0402 EIA]
C41  1uF  [Ceramic Capacitor 0603 EIA]
C42  2.2uF  [Ceramic Capacitor 0402 EIA]
C43  2.2uF  [Ceramic Capacitor 0402 EIA]
C103  100nF  [Ceramic Capacitor 0402 EIA]
C104  100nF  [Ceramic Capacitor 0402 EIA]
L2  600R(Z)  [Inductor 0603 EIA]
R2  0R  [Resistor 0603 EIA]
R55  DNP  [Resistor 0805 EIA]
U1  STM32H743BIT6  [LQFP208_STM32H743BITx]  (part D of 4)

### Blocks framed on the sheet
MCU PWR SUPPLIES: C41-C43 L2 R2 U1
SIGNALS: R55

### Ports
3V3, +3.3V (out), GND

### Nets
3V3: R55.1 ; port 3V3
+3.3V: C1.2 C2.2 C3.2 C4.2 C5.2 C6.2 C7.2 C8.2 C10.2 C15.2 C16.2 C17.2 C18.2 C19.2 C20.2 C22.2 C23.2 C41.2 C103.2 C104.2 L2.1 R55.2 U1.6(VBAT) U1.15(VDD) U1.26(VDD) U1.39(VDD) U1.52(VDD) U1.59(VDD) U1.73(VDD) U1.83(VDD) U1.94(VDD) U1.103(VDD) U1.115(VDD) U1.124(VDD) U1.137(VDD33USB) U1.150(VDD) U1.158(VDD) U1.171(VDD) U1.185(VDD) U1.204(VDD) ; port +3.3V
GND: C1.1 C2.1 C3.1 C4.1 C5.1 C6.1 C7.1 C8.1 C10.1 C11.1 C12.1 C13.1 C14.1 C15.1 C16.1 C17.1 C18.1 C19.1 C20.1 C22.1 C23.1 C41.1 C42.1 C43.1 C103.1 C104.1 U1.14(VSS) U1.25(VSS) U1.40(VSSA) U1.51(VSS) U1.60(VSS) U1.72(VSS) U1.82(VSS) U1.93(VSS) U1.114(VSS) U1.125(VSS) U1.136(VSS) U1.149(VSS) U1.170(VSS) U1.184(VSS) U1.202(VSS) ; port GND
VDDA: C13.2 C14.2 L2.2 R2.1 U1.42(VDDA)
VREF+: C11.2 C12.2 R2.2 U1.41(VREF+)
NetC42_2: C42.2 U1.148(VCAP2)
NetC43_2: C43.2 U1.92(VCAP1)

### Notes on the sheet
- MCU DECAPS
- Ceramic capacitor (Low ESR, ESR<1 Ω)
- (near R55) Fit resistors to put MCU into operation
- (near R55) Not Fitted
- (near R55) 0R
- Title
- Size:
- Date:
- A3
- Number:
- Time:
- Revision:
- Sheet
- of
- File:
- (in symbol STM32H7x3BIT, part D) 4 of 4

### Library data of the parts
C1-C8 C12 C14-C20 C22 C23 C103 C104 = Cap_100nF_0402_10V: as C40 on sheet USB; Dielectric Grade: X7R; Footprint/Package: 0402 (1005 metric); Supplier 1: Digi-Key; Supplier Part Number 1: 1276-1002-1-ND; value: 100nF
C10 = Cap_4.7uF_0603_10V: 4.7µF ±10% 10V Ceramic Capacitor X5R 0603 (1608 Metric); Manufracturer: KEMET; Manufacturer PartNr: C0603C475K8PACTU; voltage: 10VDC; Replaceable: yes; value: 4.7uF; tolerance: 10%; Dielectric Grade: X5R; Footprint/Package: 0603 (1608 metric); Supplier 1: Digi-Key; Supplier Part Number 1: 399-5503-1-ND
C11 C13 C41 = Cap_1uF_0603_25V: 1µF ±10% 25V Ceramic Capacitor X5R 0603 (1608 Metric); Manufacturer: Kemet; Manufacturer PartNr: C0603C105K3PACTU; voltage: 25VDC; Replaceable: yes; value: 1uF; tolerance: 10%; Footprint/Package: 0603 (1608 metrisch); Dielectric Grade: X5R; ComponentLink1Description: mouser; ComponentLink1URL: https://www.mouser.ch/ProductDetail/Murata-Electronics/GCM155C71A105KE38D?qs=sGAEpiMZZMsh%252b1woXyUXj0FEAttKcN54ouz5zO04smg%3d; Supplier Part Number 1: 399-7846-1-ND; Supplier 1: Digi-Key
C42 C43 = Cap_2.2uF_0402_25V: 2.2µF ±20% 25V Ceramic Capacitor X5R 0402 (1005 Metric); Manufacturer: Murata; Manufacturer PartNr: GRM155R61E225ME15D; voltage: 25VDC; Replaceable: yes; value: 2.2uF; tolerance: ±20%; Dielectric Grade: X5R; Footprint/Package: 0402; ComponentLink1Description: digikey; ComponentLink1URL: https://www.digikey.com/product-detail/en/murata-electronics-north-america/GRM155R61E225ME15D/490-10457-2-ND/5027542; Supplier 1: Digi-Key; Supplier Part Number 1: 490-10457-1-ND
L2 = Ind_600R_0603: Ferritperlen MULTILYR CHP BD 0603 600OHMS 25%; Manufacturer: Taiyo Yuden; Manufacturer PartNr: BK1608HS601-T; Replaceable: yes; current: 350mA; value: 600R(Z); tolerance: 25%; power: *; Footprint/Package: 0603; Supplier 1: Mouser; Supplier Part Number 1: 963-BK1608HS601-T
R2 = Res_0R_0603: 0 Ohms Jumper 0.1W, 1/10W Chip Resistor 0603 (1608 Metric) Moisture Resistant Thick Film; Manufacturer: Yageo; Manufacturer PartNr: RC0603JR-070RL; Replaceable: yes; value: 0R; tolerance: -; power: 0.1W, 1/10W; Footprint/Package: 0603 (1608 metric); Supplier 1: Digi-Key; Supplier Part Number 1: 311-0.0GRCT-ND; voltage: -; Dielectric Grade: -
R55 = Res_DNP_0805: as R56 on sheet USB; value: DNP; tolerance: *; power: *; Manufacturer: do not populate; Footprint/Package: 0805; Manufacturer PartNr: do not populate
U1 = STM32H7x3BIT: as U1 on sheet MCU_STM32H743BI; value: STM32H743BIT6; Type: Type; DIelectric Grade: -; Manufacturer PartNr: STM32H743BIT6; power: -; Supplier 1: Digi-Key; Supplier Part Number 1: 497-18562-ND; Footprint/Package: 208-LQFP (28x28); tolerance: -

## Sheet Micro_SD_Card.SchDoc: Micro SD Card
size A3; Author: A.Horvath; Organization: Reichle & De-MAssari; Address1: Binzstrasse 32; Address2: 8620 Wetzikon; Address3: Switzerland; DocumentNumber: 2; Revision: V0.1; SheetNumber: 2; SheetTotal: 11
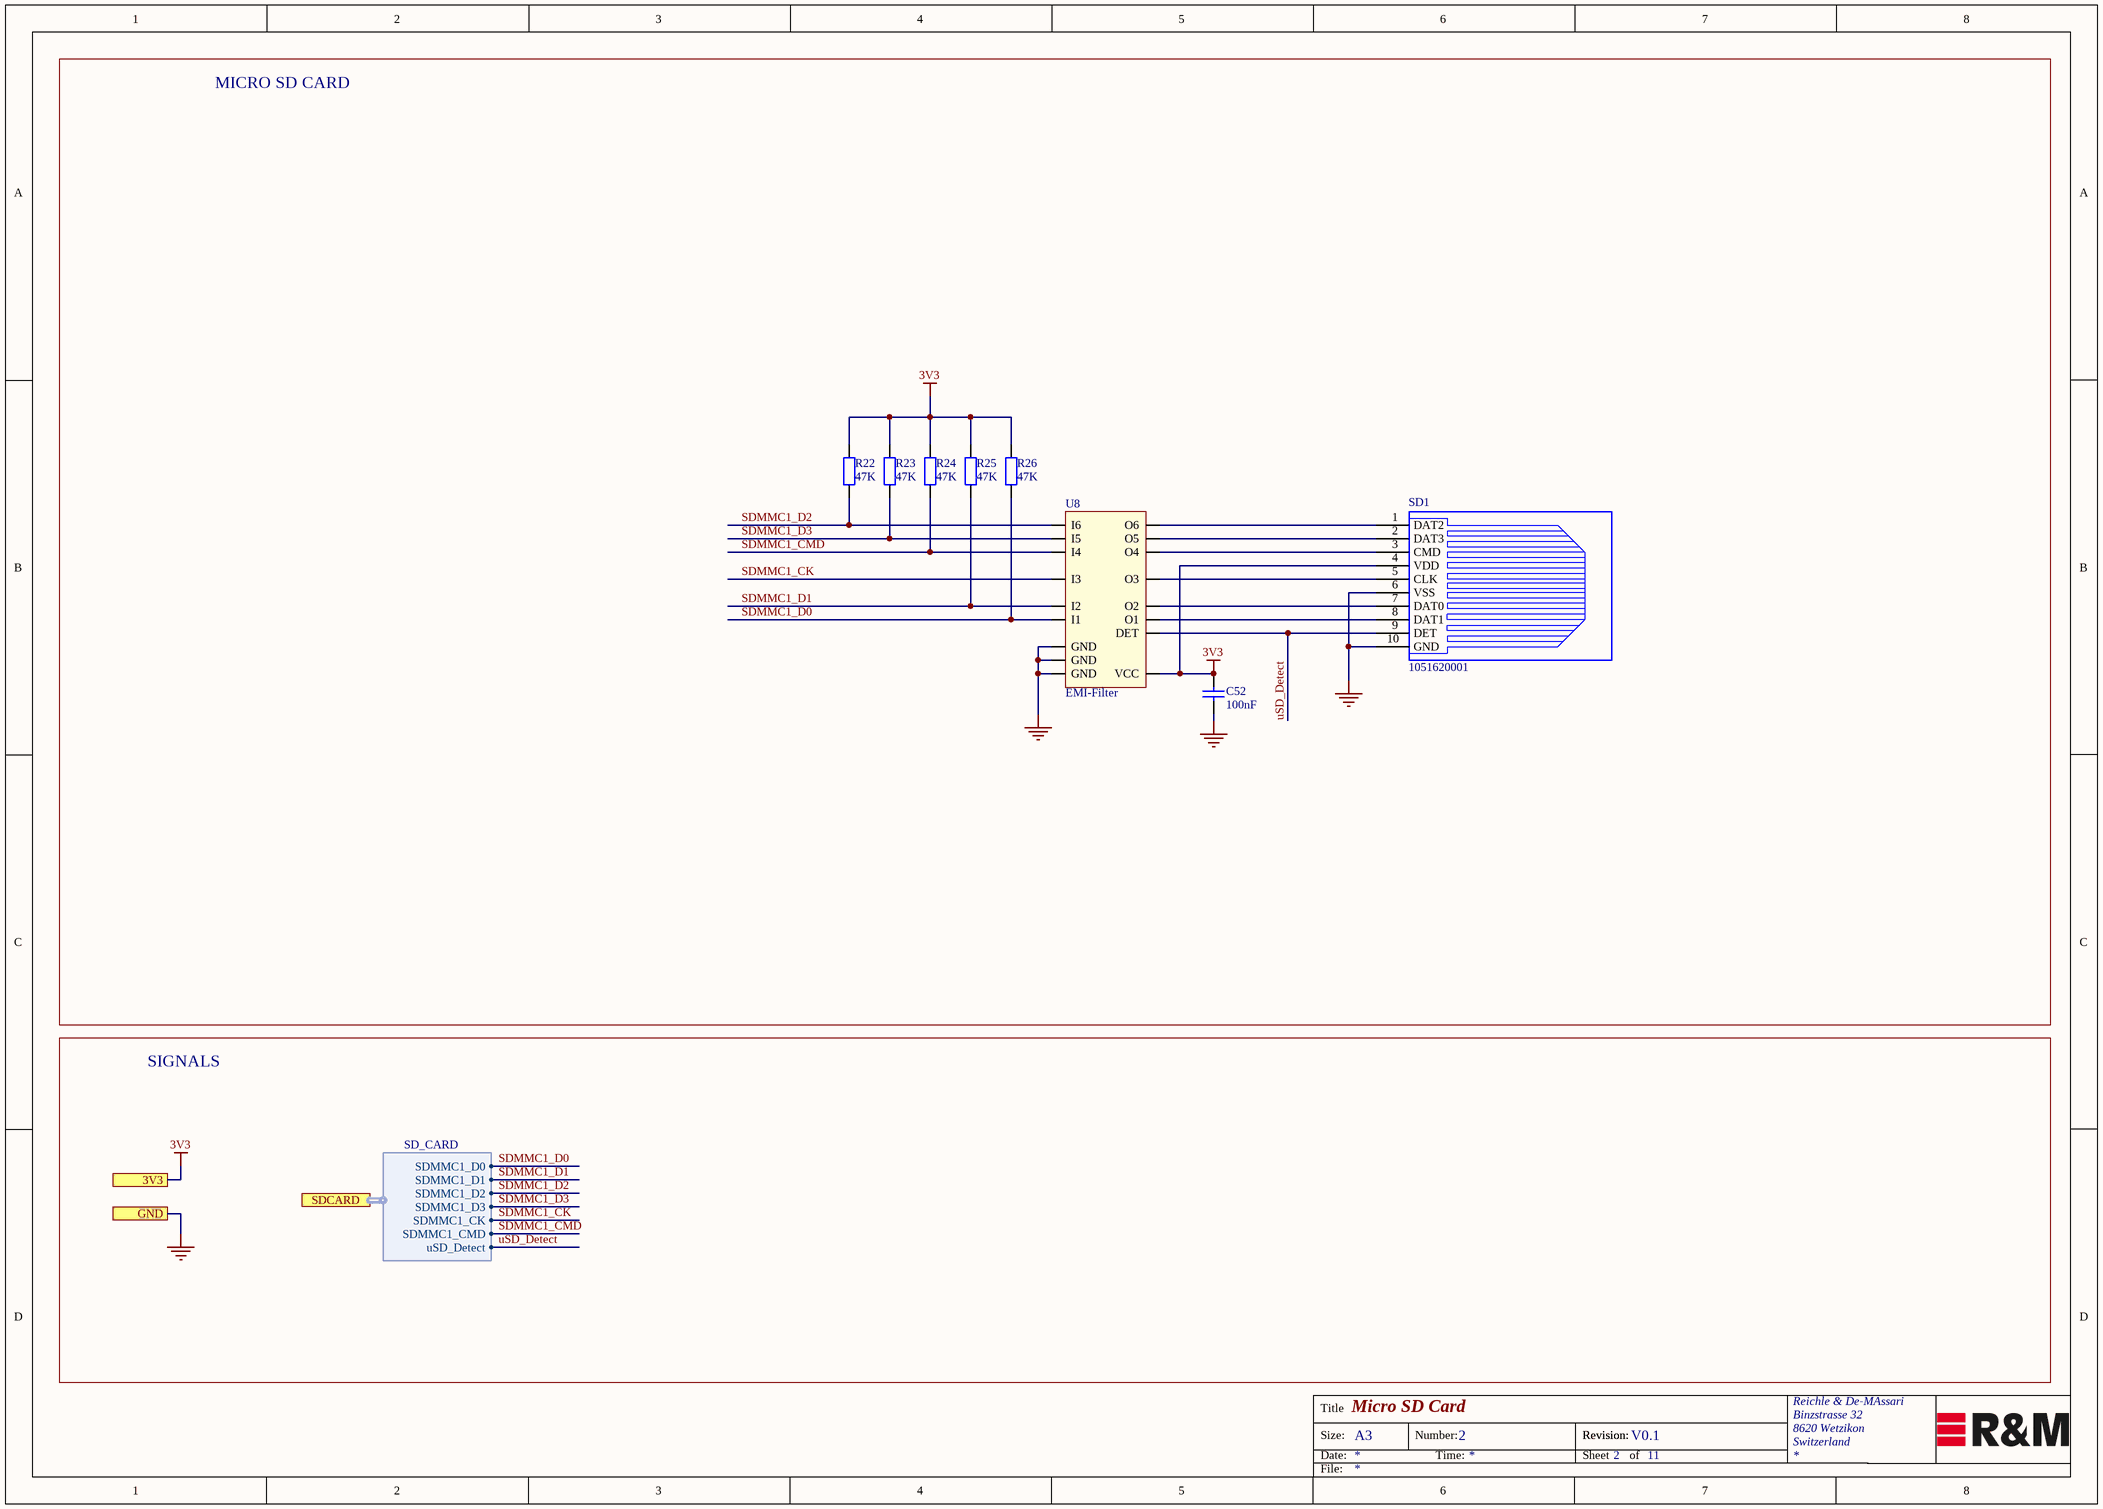
[diagram p6: Micro_SD_Card.SchDoc]

### Parts
C52  100nF  [Ceramic Capacitor 0402 EIA]
R22  47K  [Resistor 0402 EIA]
R23  47K  [Resistor 0402 EIA]
R24  47K  [Resistor 0402 EIA]
R25  47K  [Resistor 0402 EIA]
R26  47K  [Resistor 0402 EIA]
SD1  1051620001  [SD-105162-001]
U8  EMI-Filter  [WFBGA-17-Balls]

### Blocks framed on the sheet
MICRO SD CARD: C52 R22-R26 SD1 U8

### Ports
3V3, GND, SDCARD (harness SD_CARD)

### Harnesses
SD_CARD: SDMMC1_D0, SDMMC1_D1, SDMMC1_D2, SDMMC1_D3, SDMMC1_CK, SDMMC1_CMD, uSD_Detect

### Nets
3V3: C52.2 R22.1 R23.1 R24.1 R25.1 R26.1 SD1.4(VDD) U8.VCC ; port 3V3
GND: C52.1 SD1.6(VSS) SD1.10(GND) U8.GND ; port GND
SDMMC1_CK: U8.I3 ; port SDCARD.SDMMC1_CK
SDMMC1_CMD: R24.2 U8.I4 ; port SDCARD.SDMMC1_CMD
SDMMC1_D0: R26.2 U8.I1 ; port SDCARD.SDMMC1_D0
SDMMC1_D1: R25.2 U8.I2 ; port SDCARD.SDMMC1_D1
SDMMC1_D2: R22.2 U8.I6 ; port SDCARD.SDMMC1_D2
SDMMC1_D3: R23.2 U8.I5 ; port SDCARD.SDMMC1_D3
uSD_Detect: SD1.9(DET) U8.DET ; port SDCARD.uSD_Detect
NetSD1_1: SD1.1(DAT2) U8.O6
NetSD1_2: SD1.2(DAT3) U8.O5
NetSD1_3: SD1.3(CMD) U8.O4
NetSD1_5: SD1.5(CLK) U8.O3
NetSD1_7: SD1.7(DAT0) U8.O2
NetSD1_8: SD1.8(DAT1) U8.O1

### Notes on the sheet
- SIGNALS
- Title
- Size:
- Date:
- A3
- Number:
- Time:
- Revision:
- Sheet
- of
- File:

### Library data of the parts
C52 = Cap_100nF_0402_10V: as C40 on sheet USB; Dielectric Grade: X7R; Footprint/Package: 0402 (1005 metric); Supplier 1: Digi-Key; Supplier Part Number 1: 1276-1002-1-ND; value: 100nF
R22-R26 = Res_47K_0402: as R11 on sheet USB; value: 47K; tolerance: 5%; Footprint/Package: 0402 (1005); ComponentLink1Description: mouser; ComponentLink1URL: https://www.mouser.ch/ProductDetail/Yageo/RC0402FR-07412KL?qs=sGAEpiMZZMu61qfTUdNhG6gKAQVNBKOozNOFQJr2tME%3d; Supplier Part Number 1: A130058CT-ND
SD1 = CONN_MICRO_SD: Memory Card Connectors 1.45H MICRO SD HEADER WITH D/C PIN, Molex; Manufacturer: Molex, LLC; Replaceable: no; Supplier 1: Digi-Key; Supplier Part Number 1: WM14405CT-ND; Manufacturer PartNr: 1051620001; power: -; Dielectric Grade: -; voltage: -; value: 1051620001
U8 = EMI_Filter: RLC EMI Filter 3rd Order Low Pass 6 Channel L = 1nH, C = 2.5pF 17-WFBGA, FCBGA; Manufacturer: STMicroelectronics; Manufacturer PartNr: EMIF06-HSD03F3; Replaceable: no; value: EMI-Filter; tolerance: -; power: -; Footprint/Package: 17-WFBGA; Dielectric Grade: -; Supplier 1: Digi-Key; Supplier Part Number 1: 497-15334-1-ND